# EAGLE schematic unified (EAGLE 7.7.0)

## Sheet 1 of 7
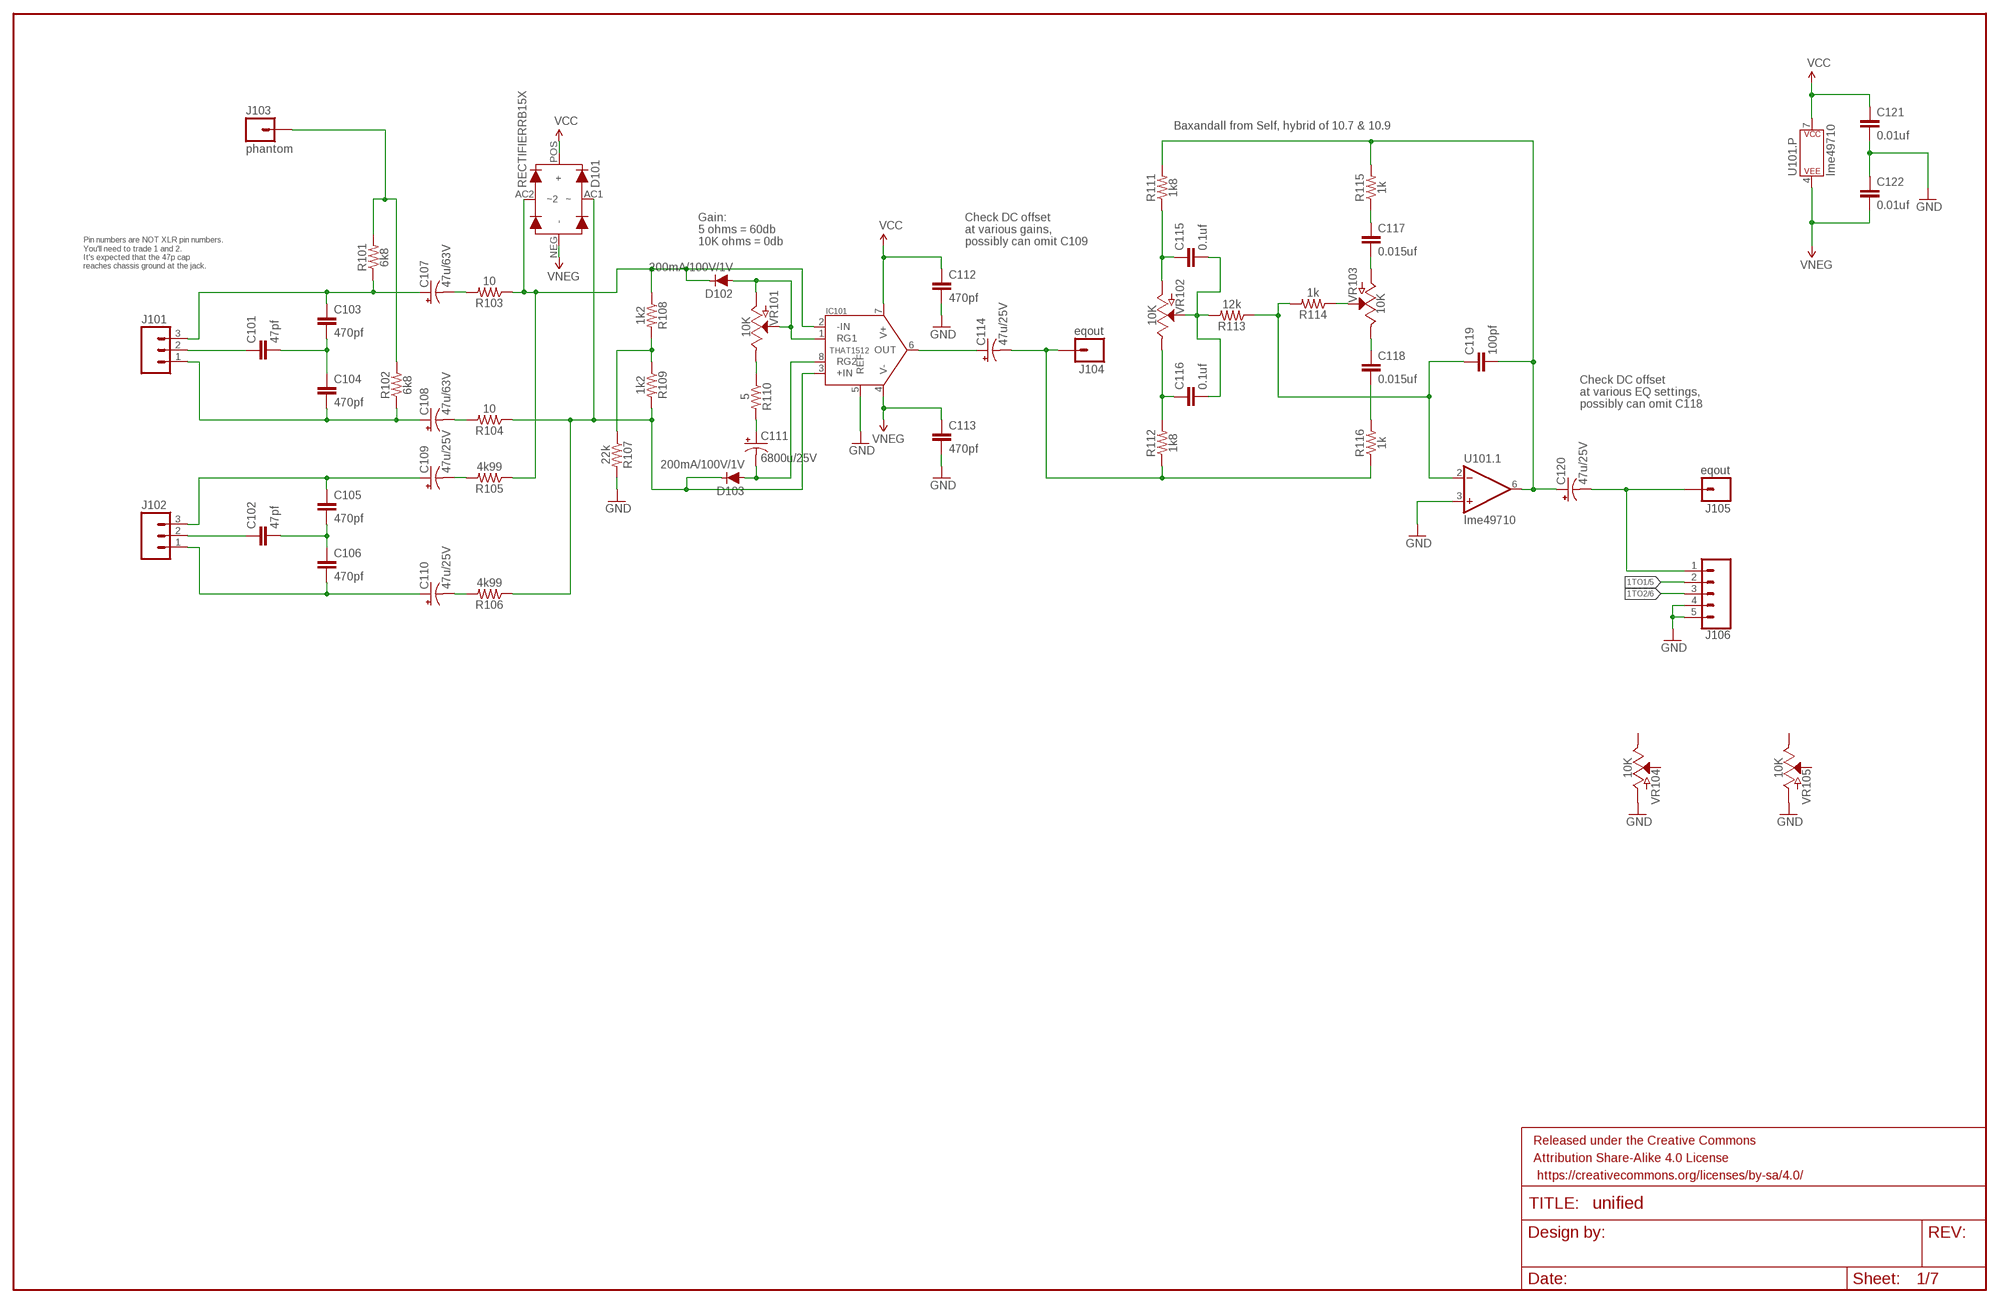
[diagram p0: schematic, sheet 1]

### Parts
C101  47pf  CAP-CERAMIC47PF  [CAP-KEMET-GM-2.54LS]
C102  47pf  CAP-CERAMIC47PF  [CAP-KEMET-GM-2.54LS]
C103  470pf  CAP-CERAMIC470PF  [CAP-KEMET-GM-2.54LS]
C104  470pf  CAP-CERAMIC470PF  [CAP-KEMET-GM-2.54LS]
C105  470pf  CAP-CERAMIC470PF  [CAP-KEMET-GM-2.54LS]
C106  470pf  CAP-CERAMIC470PF  [CAP-KEMET-GM-2.54LS]
C107  47u/63V  CAP-LYTIC47U/63V  [CAP-PANA-2LS-6DIAM]
C108  47u/63V  CAP-LYTIC47U/63V  [CAP-PANA-2LS-6DIAM]
C109  47u/25V  CAP-LYTIC47U/25V  [CAP-PANA-2LS-5DIAM]
C110  47u/25V  CAP-LYTIC47U/25V  [CAP-PANA-2LS-5DIAM]
C111  6800u/25V  CAP-LYTIC6800U/10V  [CAP-PANA-5LS-12.5DIAM]
C112  470pf  CAP-CERAMIC470PF  [CAP-KEMET-GM-2.54LS]
C113  470pf  CAP-CERAMIC470PF  [CAP-KEMET-GM-2.54LS]
C114  47u/25V  CAP-LYTIC47U/25V  [CAP-PANA-2LS-5DIAM]
C115  0.1uf  WIMA-MKS20.1UF  [WIMA-MKS2-2.5X7.2]
C116  0.1uf  WIMA-MKS20.1UF  [WIMA-MKS2-2.5X7.2]
C117  0.015uf  WIMA-MKS20.015UF  [WIMA-MKS2-2.5X7.2]
C118  0.015uf  WIMA-MKS20.015UF  [WIMA-MKS2-2.5X7.2]
C119  100pf  CAP-CERAMIC100PF  [CAP-KEMET-GM-2.54LS]
C120  47u/25V  CAP-LYTIC47U/25V  [CAP-PANA-2LS-5DIAM]
C121  0.01uf  WIMA-MKS20.01UF  [WIMA-MKS2-2.5X7.2]
C122  0.01uf  WIMA-MKS20.01UF  [WIMA-MKS2-2.5X7.2]
D101  RECTIFIERRB15X  [SM-RECTIFIER]
D102  200mA/100V/1V  DIODE-1N4148  [DIODE-1N4148]
D103  200mA/100V/1V  DIODE-1N4148  [DIODE-1N4148]
FRAME101  FRAME-LEDGER  [CREATIVE_COMMONS]
IC101  THAT1512  THAT151X  [DIP08-KIT]
J101  M031X03_NO_SILK  [1X03_NO_SILK@1]
J102  M031X03_NO_SILK  [1X03_NO_SILK@1]
J103  phantom  M01NOSILK-KIT  [1X01NS-KIT]
J104  eqout  M01NOSILK-KIT  [1X01NS-KIT]
J105  eqout  M01NOSILK-KIT  [1X01NS-KIT]
J106  CONN_05PTH_LONGPADS  [1X05_LONGPADS]
R101  6k8  RESISTOR  [AXIAL-0.3]
R102  6k8  RESISTOR  [AXIAL-0.3]
R103  10  RESISTOR  [AXIAL-0.3]
R104  10  RESISTOR  [AXIAL-0.3]
R105  4k99  RESISTOR  [AXIAL-0.3]
R106  4k99  RESISTOR  [AXIAL-0.3]
R107  22k  RESISTOR  [AXIAL-0.3]
R108  1k2  RESISTOR  [AXIAL-0.3]
R109  1k2  RESISTOR  [AXIAL-0.3]
R110  5  RESISTOR  [AXIAL-0.3]
R111  1k8  RESISTOR  [AXIAL-0.3]
R112  1k8  RESISTOR  [AXIAL-0.3]
R113  12k  RESISTOR  [AXIAL-0.3]
R114  1k  RESISTOR  [AXIAL-0.3]
R115  1k  RESISTOR  [AXIAL-0.3]
R116  1k  RESISTOR  [AXIAL-0.3]
U101  lme49710  OPAMPLME49710  [DIP08-KIT]
VR101  10K  POTROT-SW-POT  [ROT-SW-POT]
VR102  10K  POT10K-VERTPIN  [ALPHA-RV24AF40-POT]
VR103  10K  POT10K-VERTPIN  [ALPHA-RV24AF40-POT]
VR104  10K  POT10K-VERTPIN  [ALPHA-RV24AF40-POT]
VR105  10K  POT10K-VERTPIN  [ALPHA-RV24AF40-POT]

### Nets
1TO1 [signal]: J106.2 ; also sheet 5
1TO2 [signal]: J106.3 ; also sheet 6
EQ1OUT [signal]: C120.NEG(-) J105.1 J106.1
GND [power]: C112.P$2 C113.P$2 C121.P$2 C122.P$1 IC101.5(REF) J106.4 J106.5 R107.P$2 U101.3(.1:+IN) VR104.CCW(A) VR105.CCW(A) ; also sheet 2,3,4,5,6,7
L1+ [signal]: C106.P$2 C110.POS(+) J102.1
L1- [signal]: C105.P$1 C109.POS(+) J102.3
L1GND [signal]: C102.P$1 J102.2
M1+ [signal]: C104.P$2 C108.POS(+) J101.1 R102.P$1
M1- [signal]: C103.P$1 C107.POS(+) J101.3 R101.P$1
M1GND [signal]: C101.P$1 J101.2
N$1 [signal]: C115.P$1 R111.P$1 VR102.CCW(A)
N$2 [signal]: C116.P$1 R112.P$2 VR102.CW(E)
N$3 [signal]: C119.P$1 R113.P$1 R114.P$2 U101.2(.1:-IN)
N$4 [signal]: C118.P$2 R116.P$2
N$6 [signal]: C119.P$2 C120.POS(+) R111.P$2 R115.P$2 U101.6(.1:OUT)
N$8: R114.P$1 VR103.WIP(S)
N$10: C118.P$1 VR103.CW(E)
N$14 [signal]: C115.P$2 C116.P$2 R113.P$2 VR102.WIP(S)
N$15: C117.P$2 VR103.CCW(A)
N$19: C117.P$1 R115.P$1
N$21 [signal]: C111.NEG(-) D103.A IC101.8(RG2)
N$22 [signal]: C114.POS(+) IC101.6(OUT)
N$24 [signal]: C101.P$2 C103.P$2 C104.P$1
N$27 [signal]: C108.NEG(-) R104.P$2
N$28: J103.1 R101.P$2 R102.P$2
N$29 [signal]: C107.NEG(-) R103.P$2
N$30 [signal]: D101.AC2(~2) D102.C IC101.2(-IN) R103.P$1 R105.P$1 R108.P$1
N$31 [signal]: D101.AC1(~) D103.C IC101.3(+IN) R104.P$1 R106.P$1 R109.P$2
N$32 [signal]: R107.P$1 R108.P$2 R109.P$1
N$33: D102.A IC101.1(RG1) VR101.CCW(A) VR101.WIP(S)
N$34 [signal]: R110.P$1 VR101.CW(E)
N$35 [signal]: C111.POS(+) R110.P$2
N$37 [signal]: C102.P$2 C105.P$2 C106.P$1
N$40 [signal]: C110.NEG(-) R106.P$2
N$42 [signal]: C109.NEG(-) R105.P$2
PREOUT [signal]: C114.NEG(-) J104.1 R112.P$1 R116.P$1
VCC [power]: C112.P$1 C121.P$1 D101.POS(+) IC101.7(V+) U101.7(.P:P$V+) ; also sheet 2,3,4,5,6,7
VNEG [power]: C113.P$1 C122.P$2 D101.NEG(-) IC101.4(V-) U101.4(.P:P$V-) ; also sheet 2,3,4,5,6,7
Unconnected: VR104.CW(E) VR104.WIP(S) VR105.CW(E) VR105.WIP(S)

### Notes on the sheet
- Baxandall from Self, hybrid of 10.7 & 10.9
- Gain: 
  5 ohms = 60db
  10K ohms = 0db
- Check DC offset 
  at various gains,
  possibly can omit C109
- Pin numbers are NOT XLR pin numbers.
  You'll need to trade 1 and 2.
  It's expected that the 47p cap
  reaches chassis ground at the jack.
- Check DC offset 
  at various EQ settings,
  possibly can omit C118

## Sheet 2 of 7
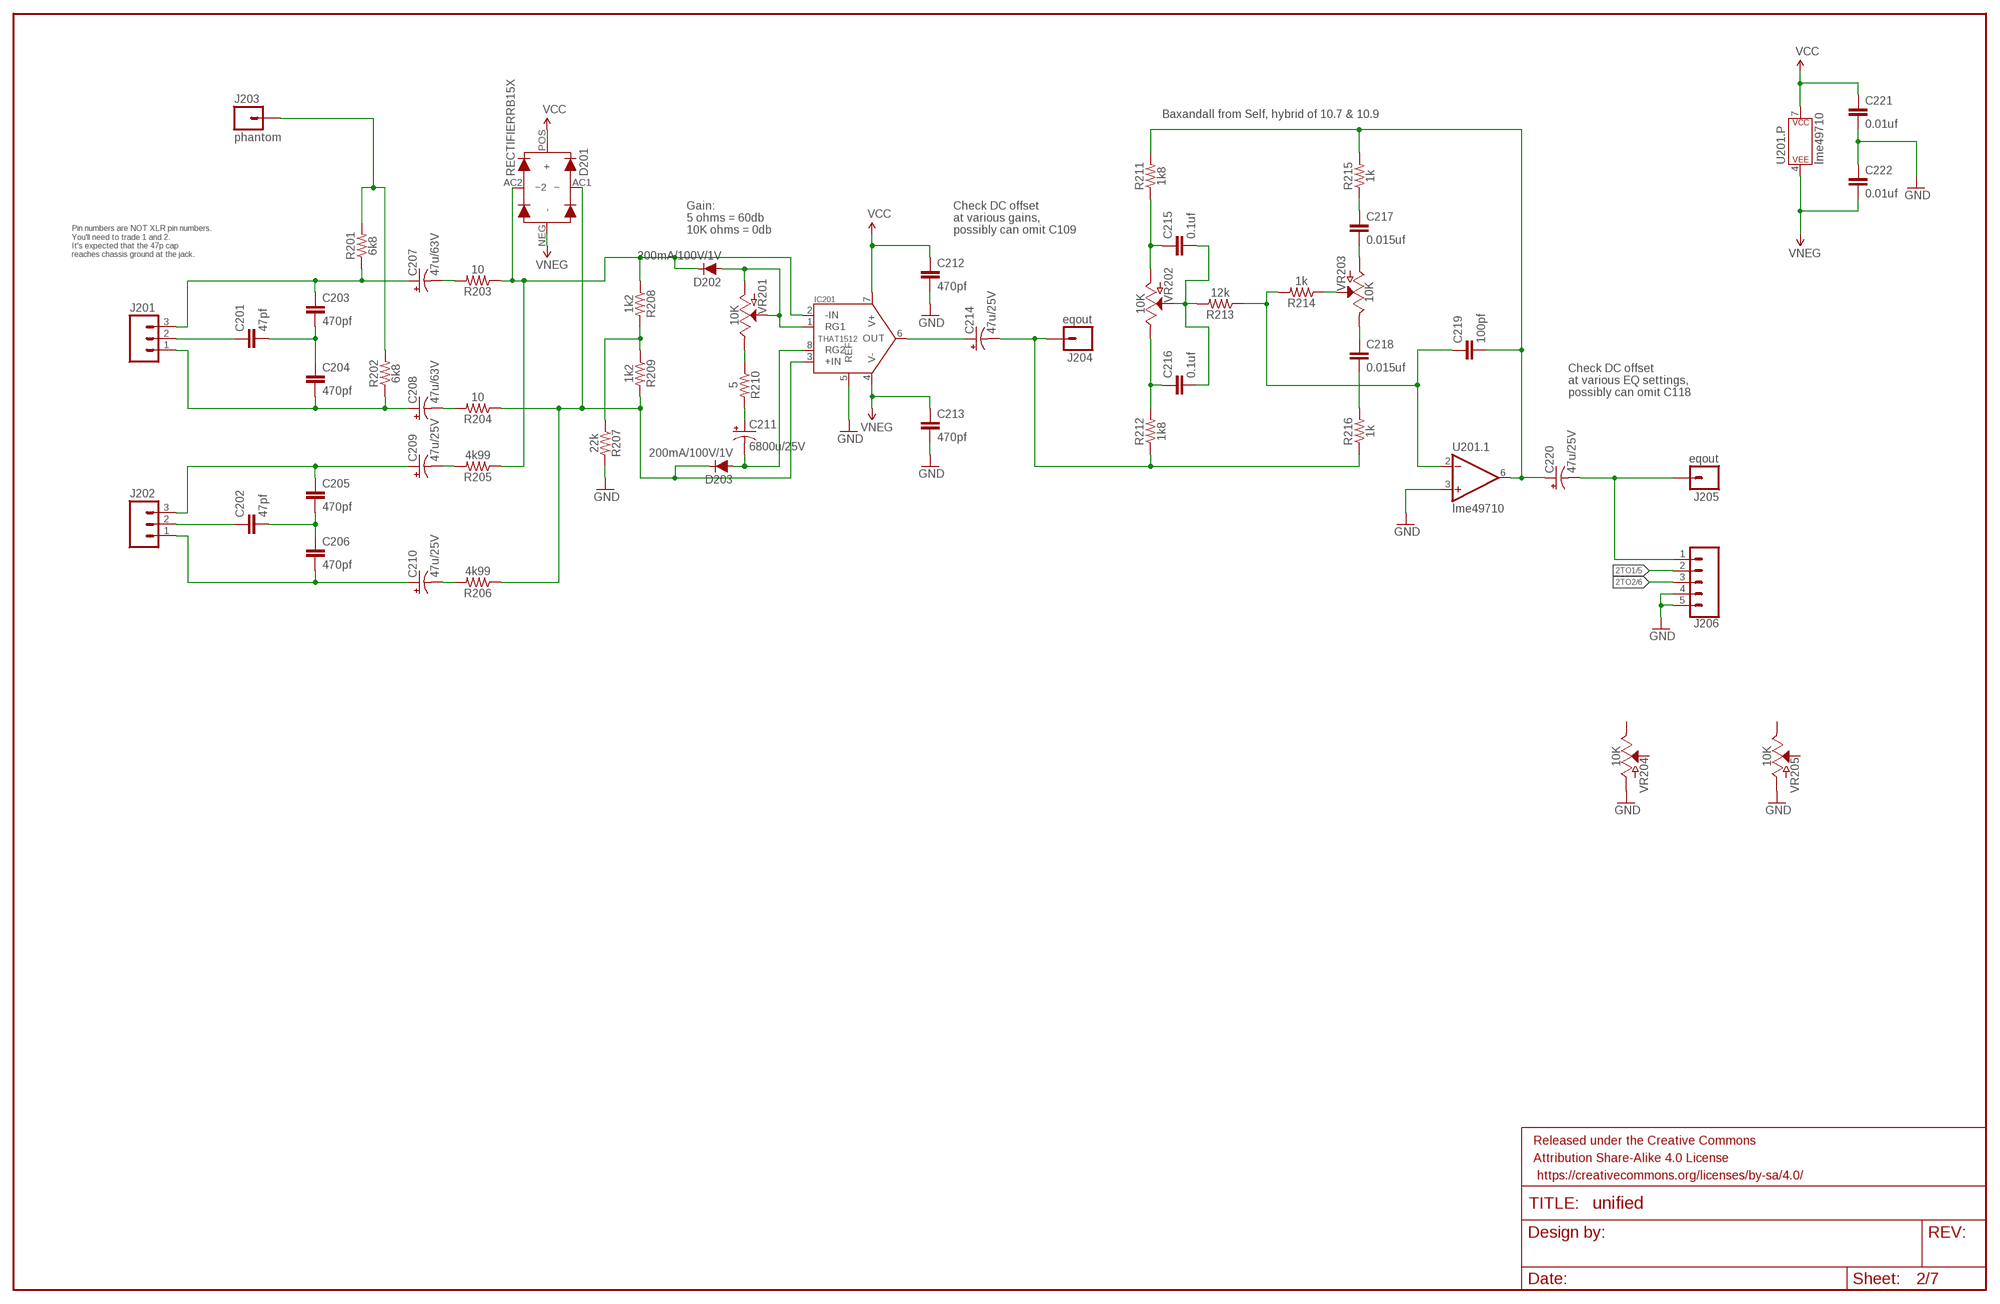
[diagram p1: schematic, sheet 2]

### Parts
C201  47pf  CAP-CERAMIC47PF  [CAP-KEMET-GM-2.54LS]
C202  47pf  CAP-CERAMIC47PF  [CAP-KEMET-GM-2.54LS]
C203  470pf  CAP-CERAMIC470PF  [CAP-KEMET-GM-2.54LS]
C204  470pf  CAP-CERAMIC470PF  [CAP-KEMET-GM-2.54LS]
C205  470pf  CAP-CERAMIC470PF  [CAP-KEMET-GM-2.54LS]
C206  470pf  CAP-CERAMIC470PF  [CAP-KEMET-GM-2.54LS]
C207  47u/63V  CAP-LYTIC47U/63V  [CAP-PANA-2LS-6DIAM]
C208  47u/63V  CAP-LYTIC47U/63V  [CAP-PANA-2LS-6DIAM]
C209  47u/25V  CAP-LYTIC47U/25V  [CAP-PANA-2LS-5DIAM]
C210  47u/25V  CAP-LYTIC47U/25V  [CAP-PANA-2LS-5DIAM]
C211  6800u/25V  CAP-LYTIC6800U/10V  [CAP-PANA-5LS-12.5DIAM]
C212  470pf  CAP-CERAMIC470PF  [CAP-KEMET-GM-2.54LS]
C213  470pf  CAP-CERAMIC470PF  [CAP-KEMET-GM-2.54LS]
C214  47u/25V  CAP-LYTIC47U/25V  [CAP-PANA-2LS-5DIAM]
C215  0.1uf  WIMA-MKS20.1UF  [WIMA-MKS2-2.5X7.2]
C216  0.1uf  WIMA-MKS20.1UF  [WIMA-MKS2-2.5X7.2]
C217  0.015uf  WIMA-MKS20.015UF  [WIMA-MKS2-2.5X7.2]
C218  0.015uf  WIMA-MKS20.015UF  [WIMA-MKS2-2.5X7.2]
C219  100pf  CAP-CERAMIC100PF  [CAP-KEMET-GM-2.54LS]
C220  47u/25V  CAP-LYTIC47U/25V  [CAP-PANA-2LS-5DIAM]
C221  0.01uf  WIMA-MKS20.01UF  [WIMA-MKS2-2.5X7.2]
C222  0.01uf  WIMA-MKS20.01UF  [WIMA-MKS2-2.5X7.2]
D201  RECTIFIERRB15X  [SM-RECTIFIER]
D202  200mA/100V/1V  DIODE-1N4148  [DIODE-1N4148]
D203  200mA/100V/1V  DIODE-1N4148  [DIODE-1N4148]
FRAME201  FRAME-LEDGER  [CREATIVE_COMMONS]
IC201  THAT1512  THAT151X  [DIP08-KIT]
J201  M031X03_NO_SILK  [1X03_NO_SILK@1]
J202  M031X03_NO_SILK  [1X03_NO_SILK@1]
J203  phantom  M01NOSILK-KIT  [1X01NS-KIT]
J204  eqout  M01NOSILK-KIT  [1X01NS-KIT]
J205  eqout  M01NOSILK-KIT  [1X01NS-KIT]
J206  CONN_05PTH_LONGPADS  [1X05_LONGPADS]
R201  6k8  RESISTOR  [AXIAL-0.3]
R202  6k8  RESISTOR  [AXIAL-0.3]
R203  10  RESISTOR  [AXIAL-0.3]
R204  10  RESISTOR  [AXIAL-0.3]
R205  4k99  RESISTOR  [AXIAL-0.3]
R206  4k99  RESISTOR  [AXIAL-0.3]
R207  22k  RESISTOR  [AXIAL-0.3]
R208  1k2  RESISTOR  [AXIAL-0.3]
R209  1k2  RESISTOR  [AXIAL-0.3]
R210  5  RESISTOR  [AXIAL-0.3]
R211  1k8  RESISTOR  [AXIAL-0.3]
R212  1k8  RESISTOR  [AXIAL-0.3]
R213  12k  RESISTOR  [AXIAL-0.3]
R214  1k  RESISTOR  [AXIAL-0.3]
R215  1k  RESISTOR  [AXIAL-0.3]
R216  1k  RESISTOR  [AXIAL-0.3]
U201  lme49710  OPAMPLME49710  [DIP08-KIT]
VR201  10K  POTROT-SW-POT  [ROT-SW-POT]
VR202  10K  POT10K-VERTPIN  [ALPHA-RV24AF40-POT]
VR203  10K  POT10K-VERTPIN  [ALPHA-RV24AF40-POT]
VR204  10K  POT10K-VERTPIN  [ALPHA-RV24AF40-POT]
VR205  10K  POT10K-VERTPIN  [ALPHA-RV24AF40-POT]

### Nets
2TO1 [signal]: J206.2 ; also sheet 5
2TO2 [signal]: J206.3 ; also sheet 6
EQ2OUT: C220.NEG(-) J205.1 J206.1
GND [power]: C212.P$2 C213.P$2 C221.P$2 C222.P$1 IC201.5(REF) J206.4 J206.5 R207.P$2 U201.3(.1:+IN) VR204.CCW(A) VR205.CCW(A) ; also sheet 1,3,4,5,6,7
N$20: C214.NEG(-) J204.1 R212.P$1 R216.P$1
N$50: C215.P$1 R211.P$1 VR202.CCW(A)
N$55: C216.P$1 R212.P$2 VR202.CW(E)
N$56: R214.P$1 VR203.WIP(S)
N$57: C215.P$2 C216.P$2 R213.P$2 VR202.WIP(S)
N$58: C218.P$2 R216.P$2
N$59: C217.P$1 R215.P$1
N$60: C219.P$1 R213.P$1 R214.P$2 U201.2(.1:-IN)
N$61: C214.POS(+) IC201.6(OUT)
N$62: C201.P$1 J201.2
N$63: C201.P$2 C203.P$2 C204.P$1
N$64: C203.P$1 C207.POS(+) J201.3 R201.P$1
N$65: C204.P$2 C208.POS(+) J201.1 R202.P$1
N$66: C208.NEG(-) R204.P$2
N$67: J203.1 R201.P$2 R202.P$2
N$68: C207.NEG(-) R203.P$2
N$69: R207.P$1 R208.P$2 R209.P$1
N$70: C211.NEG(-) D203.A IC201.8(RG2)
N$71: D202.A IC201.1(RG1) VR201.CCW(A) VR201.WIP(S)
N$72: C218.P$1 VR203.CW(E)
N$73: C217.P$2 VR203.CCW(A)
N$74: R210.P$1 VR201.CW(E)
N$75: C211.POS(+) R210.P$2
N$76: C202.P$1 J202.2
N$77: C202.P$2 C205.P$2 C206.P$1
N$78: C205.P$1 C209.POS(+) J202.3
N$79: C206.P$2 C210.POS(+) J202.1
N$80: C210.NEG(-) R206.P$2
N$81: C209.NEG(-) R205.P$2
N$82: D201.AC2(~2) D202.C IC201.2(-IN) R203.P$1 R205.P$1 R208.P$1
N$83: D201.AC1(~) D203.C IC201.3(+IN) R204.P$1 R206.P$1 R209.P$2
N$84: C219.P$2 C220.POS(+) R211.P$2 R215.P$2 U201.6(.1:OUT)
VCC [power]: C212.P$1 C221.P$1 D201.POS(+) IC201.7(V+) U201.7(.P:P$V+) ; also sheet 1,3,4,5,6,7
VNEG [power]: C213.P$1 C222.P$2 D201.NEG(-) IC201.4(V-) U201.4(.P:P$V-) ; also sheet 1,3,4,5,6,7
Unconnected: VR204.CW(E) VR204.WIP(S) VR205.CW(E) VR205.WIP(S)

### Notes on the sheet
- Baxandall from Self, hybrid of 10.7 & 10.9
- Gain: 
  5 ohms = 60db
  10K ohms = 0db
- Check DC offset 
  at various gains,
  possibly can omit C109
- Pin numbers are NOT XLR pin numbers.
  You'll need to trade 1 and 2.
  It's expected that the 47p cap
  reaches chassis ground at the jack.
- Check DC offset 
  at various EQ settings,
  possibly can omit C118

## Sheet 3 of 7
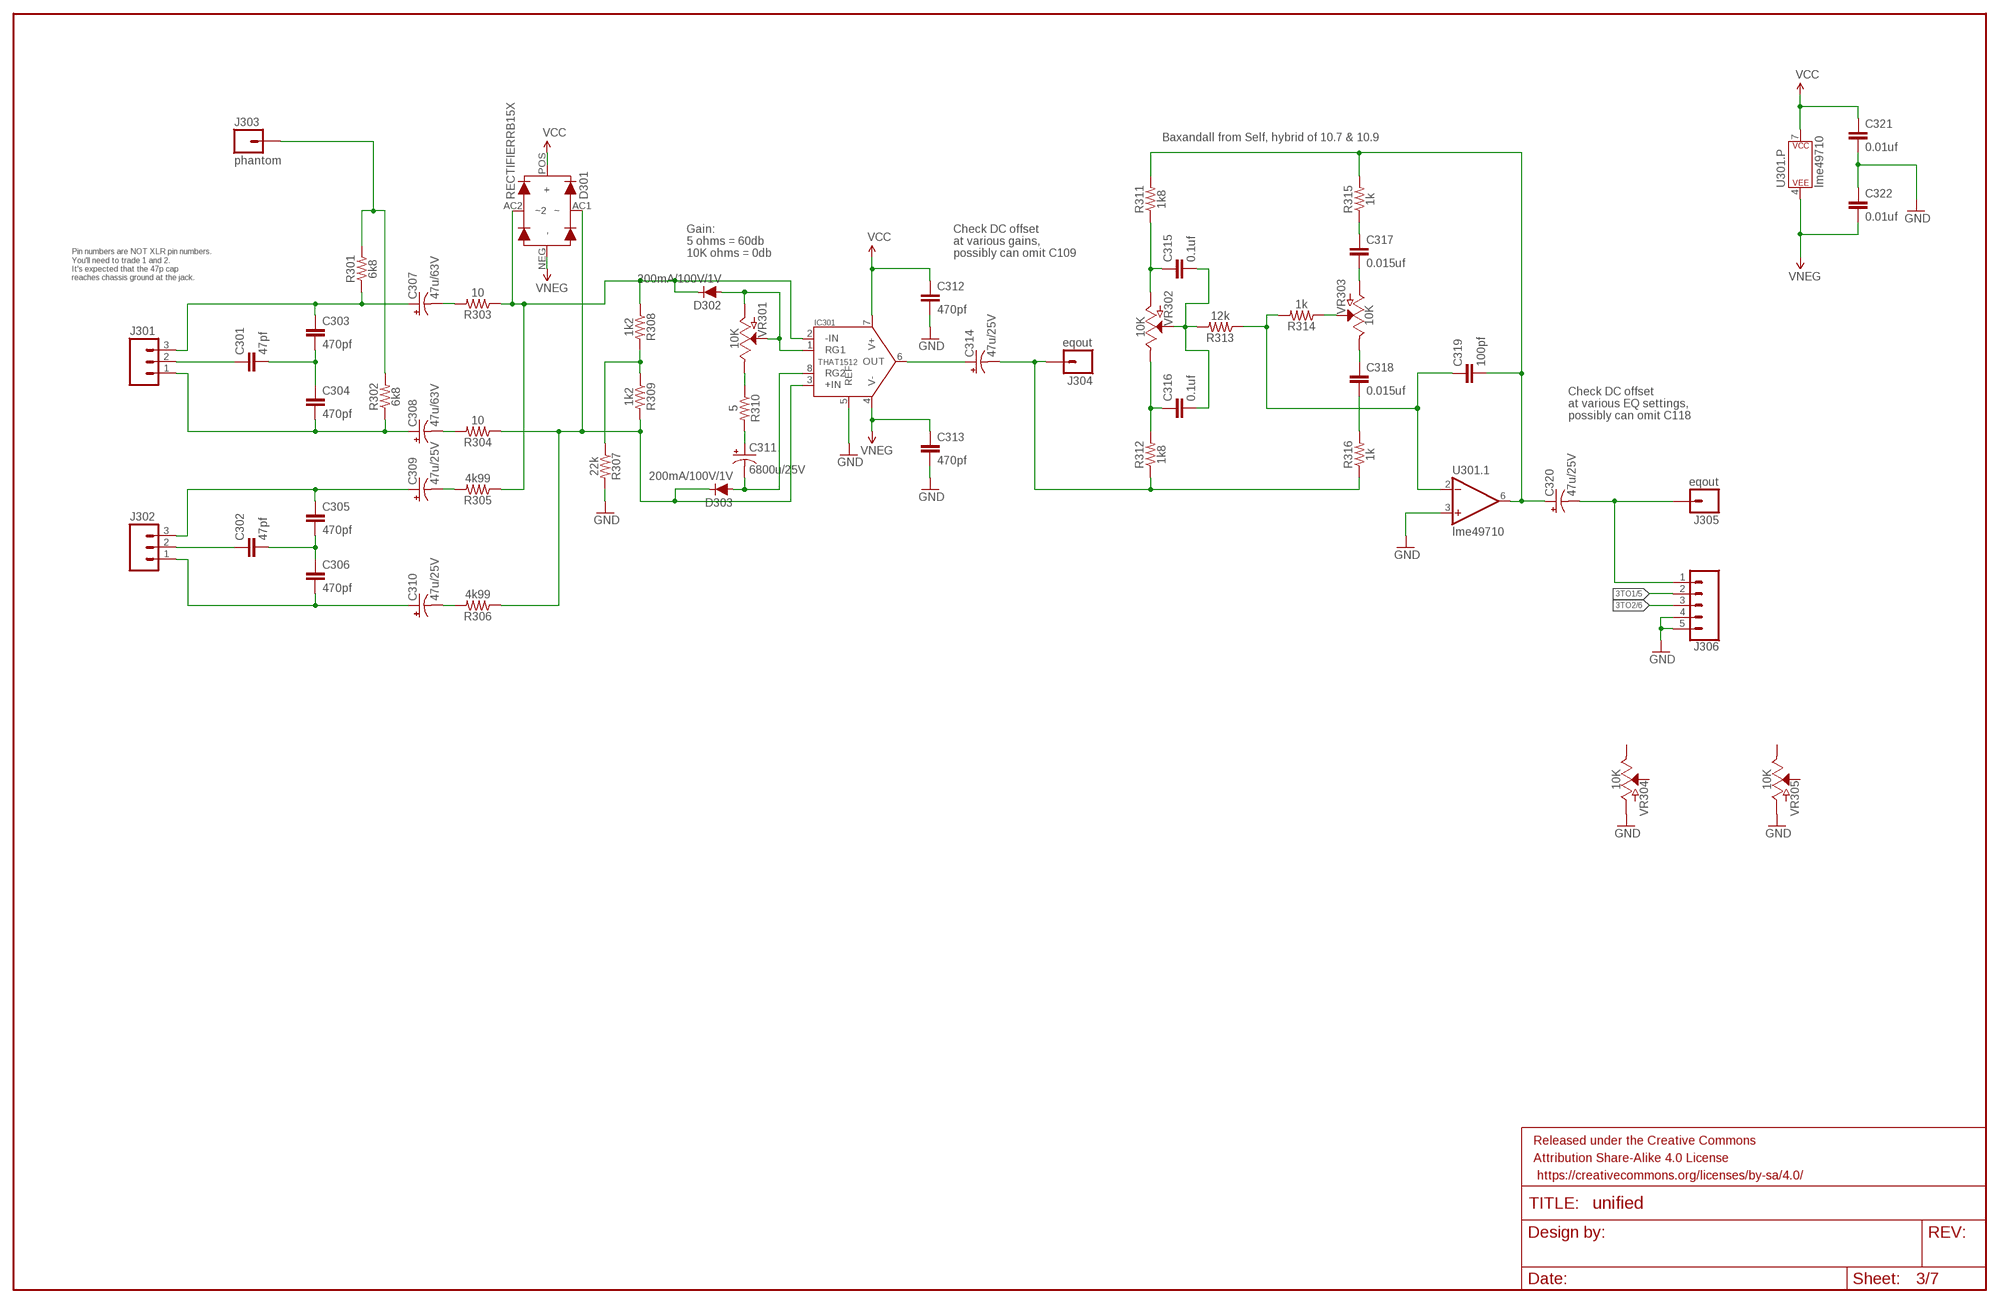
[diagram p2: schematic, sheet 3]

### Parts
C301  47pf  CAP-CERAMIC47PF  [CAP-KEMET-GM-2.54LS]
C302  47pf  CAP-CERAMIC47PF  [CAP-KEMET-GM-2.54LS]
C303  470pf  CAP-CERAMIC470PF  [CAP-KEMET-GM-2.54LS]
C304  470pf  CAP-CERAMIC470PF  [CAP-KEMET-GM-2.54LS]
C305  470pf  CAP-CERAMIC470PF  [CAP-KEMET-GM-2.54LS]
C306  470pf  CAP-CERAMIC470PF  [CAP-KEMET-GM-2.54LS]
C307  47u/63V  CAP-LYTIC47U/63V  [CAP-PANA-2LS-6DIAM]
C308  47u/63V  CAP-LYTIC47U/63V  [CAP-PANA-2LS-6DIAM]
C309  47u/25V  CAP-LYTIC47U/25V  [CAP-PANA-2LS-5DIAM]
C310  47u/25V  CAP-LYTIC47U/25V  [CAP-PANA-2LS-5DIAM]
C311  6800u/25V  CAP-LYTIC6800U/10V  [CAP-PANA-5LS-12.5DIAM]
C312  470pf  CAP-CERAMIC470PF  [CAP-KEMET-GM-2.54LS]
C313  470pf  CAP-CERAMIC470PF  [CAP-KEMET-GM-2.54LS]
C314  47u/25V  CAP-LYTIC47U/25V  [CAP-PANA-2LS-5DIAM]
C315  0.1uf  WIMA-MKS20.1UF  [WIMA-MKS2-2.5X7.2]
C316  0.1uf  WIMA-MKS20.1UF  [WIMA-MKS2-2.5X7.2]
C317  0.015uf  WIMA-MKS20.015UF  [WIMA-MKS2-2.5X7.2]
C318  0.015uf  WIMA-MKS20.015UF  [WIMA-MKS2-2.5X7.2]
C319  100pf  CAP-CERAMIC100PF  [CAP-KEMET-GM-2.54LS]
C320  47u/25V  CAP-LYTIC47U/25V  [CAP-PANA-2LS-5DIAM]
C321  0.01uf  WIMA-MKS20.01UF  [WIMA-MKS2-2.5X7.2]
C322  0.01uf  WIMA-MKS20.01UF  [WIMA-MKS2-2.5X7.2]
D301  RECTIFIERRB15X  [SM-RECTIFIER]
D302  200mA/100V/1V  DIODE-1N4148  [DIODE-1N4148]
D303  200mA/100V/1V  DIODE-1N4148  [DIODE-1N4148]
FRAME301  FRAME-LEDGER  [CREATIVE_COMMONS]
IC301  THAT1512  THAT151X  [DIP08-KIT]
J301  M031X03_NO_SILK  [1X03_NO_SILK@1]
J302  M031X03_NO_SILK  [1X03_NO_SILK@1]
J303  phantom  M01NOSILK-KIT  [1X01NS-KIT]
J304  eqout  M01NOSILK-KIT  [1X01NS-KIT]
J305  eqout  M01NOSILK-KIT  [1X01NS-KIT]
J306  CONN_05PTH_LONGPADS  [1X05_LONGPADS]
R301  6k8  RESISTOR  [AXIAL-0.3]
R302  6k8  RESISTOR  [AXIAL-0.3]
R303  10  RESISTOR  [AXIAL-0.3]
R304  10  RESISTOR  [AXIAL-0.3]
R305  4k99  RESISTOR  [AXIAL-0.3]
R306  4k99  RESISTOR  [AXIAL-0.3]
R307  22k  RESISTOR  [AXIAL-0.3]
R308  1k2  RESISTOR  [AXIAL-0.3]
R309  1k2  RESISTOR  [AXIAL-0.3]
R310  5  RESISTOR  [AXIAL-0.3]
R311  1k8  RESISTOR  [AXIAL-0.3]
R312  1k8  RESISTOR  [AXIAL-0.3]
R313  12k  RESISTOR  [AXIAL-0.3]
R314  1k  RESISTOR  [AXIAL-0.3]
R315  1k  RESISTOR  [AXIAL-0.3]
R316  1k  RESISTOR  [AXIAL-0.3]
U301  lme49710  OPAMPLME49710  [DIP08-KIT]
VR301  10K  POTROT-SW-POT  [ROT-SW-POT]
VR302  10K  POT10K-VERTPIN  [ALPHA-RV24AF40-POT]
VR303  10K  POT10K-VERTPIN  [ALPHA-RV24AF40-POT]
VR304  10K  POT10K-VERTPIN  [ALPHA-RV24AF40-POT]
VR305  10K  POT10K-VERTPIN  [ALPHA-RV24AF40-POT]

### Nets
3TO1 [signal]: J306.2 ; also sheet 5
3TO2 [signal]: J306.3 ; also sheet 6
EQ3OUT: C320.NEG(-) J305.1 J306.1
GND [power]: C312.P$2 C313.P$2 C321.P$2 C322.P$1 IC301.5(REF) J306.4 J306.5 R307.P$2 U301.3(.1:+IN) VR304.CCW(A) VR305.CCW(A) ; also sheet 1,2,4,5,6,7
N$85: C314.NEG(-) J304.1 R312.P$1 R316.P$1
N$86: C315.P$1 R311.P$1 VR302.CCW(A)
N$87: C316.P$1 R312.P$2 VR302.CW(E)
N$88: R314.P$1 VR303.WIP(S)
N$89: C315.P$2 C316.P$2 R313.P$2 VR302.WIP(S)
N$90: C318.P$2 R316.P$2
N$91: C317.P$1 R315.P$1
N$92: C319.P$1 R313.P$1 R314.P$2 U301.2(.1:-IN)
N$93: C314.POS(+) IC301.6(OUT)
N$94: C301.P$1 J301.2
N$95: C301.P$2 C303.P$2 C304.P$1
N$96: C303.P$1 C307.POS(+) J301.3 R301.P$1
N$97: C304.P$2 C308.POS(+) J301.1 R302.P$1
N$98: C308.NEG(-) R304.P$2
N$99: J303.1 R301.P$2 R302.P$2
N$100: C307.NEG(-) R303.P$2
N$101: R307.P$1 R308.P$2 R309.P$1
N$102: C311.NEG(-) D303.A IC301.8(RG2)
N$103: D302.A IC301.1(RG1) VR301.CCW(A) VR301.WIP(S)
N$104: C318.P$1 VR303.CW(E)
N$105: C317.P$2 VR303.CCW(A)
N$106: R310.P$1 VR301.CW(E)
N$107: C311.POS(+) R310.P$2
N$108: C302.P$1 J302.2
N$109: C302.P$2 C305.P$2 C306.P$1
N$110: C305.P$1 C309.POS(+) J302.3
N$111: C306.P$2 C310.POS(+) J302.1
N$112: C310.NEG(-) R306.P$2
N$113: C309.NEG(-) R305.P$2
N$114: D301.AC2(~2) D302.C IC301.2(-IN) R303.P$1 R305.P$1 R308.P$1
N$115: D301.AC1(~) D303.C IC301.3(+IN) R304.P$1 R306.P$1 R309.P$2
N$116: C319.P$2 C320.POS(+) R311.P$2 R315.P$2 U301.6(.1:OUT)
VCC [power]: C312.P$1 C321.P$1 D301.POS(+) IC301.7(V+) U301.7(.P:P$V+) ; also sheet 1,2,4,5,6,7
VNEG [power]: C313.P$1 C322.P$2 D301.NEG(-) IC301.4(V-) U301.4(.P:P$V-) ; also sheet 1,2,4,5,6,7
Unconnected: VR304.CW(E) VR304.WIP(S) VR305.CW(E) VR305.WIP(S)

### Notes on the sheet
- Baxandall from Self, hybrid of 10.7 & 10.9
- Gain: 
  5 ohms = 60db
  10K ohms = 0db
- Check DC offset 
  at various gains,
  possibly can omit C109
- Pin numbers are NOT XLR pin numbers.
  You'll need to trade 1 and 2.
  It's expected that the 47p cap
  reaches chassis ground at the jack.
- Check DC offset 
  at various EQ settings,
  possibly can omit C118

## Sheet 4 of 7
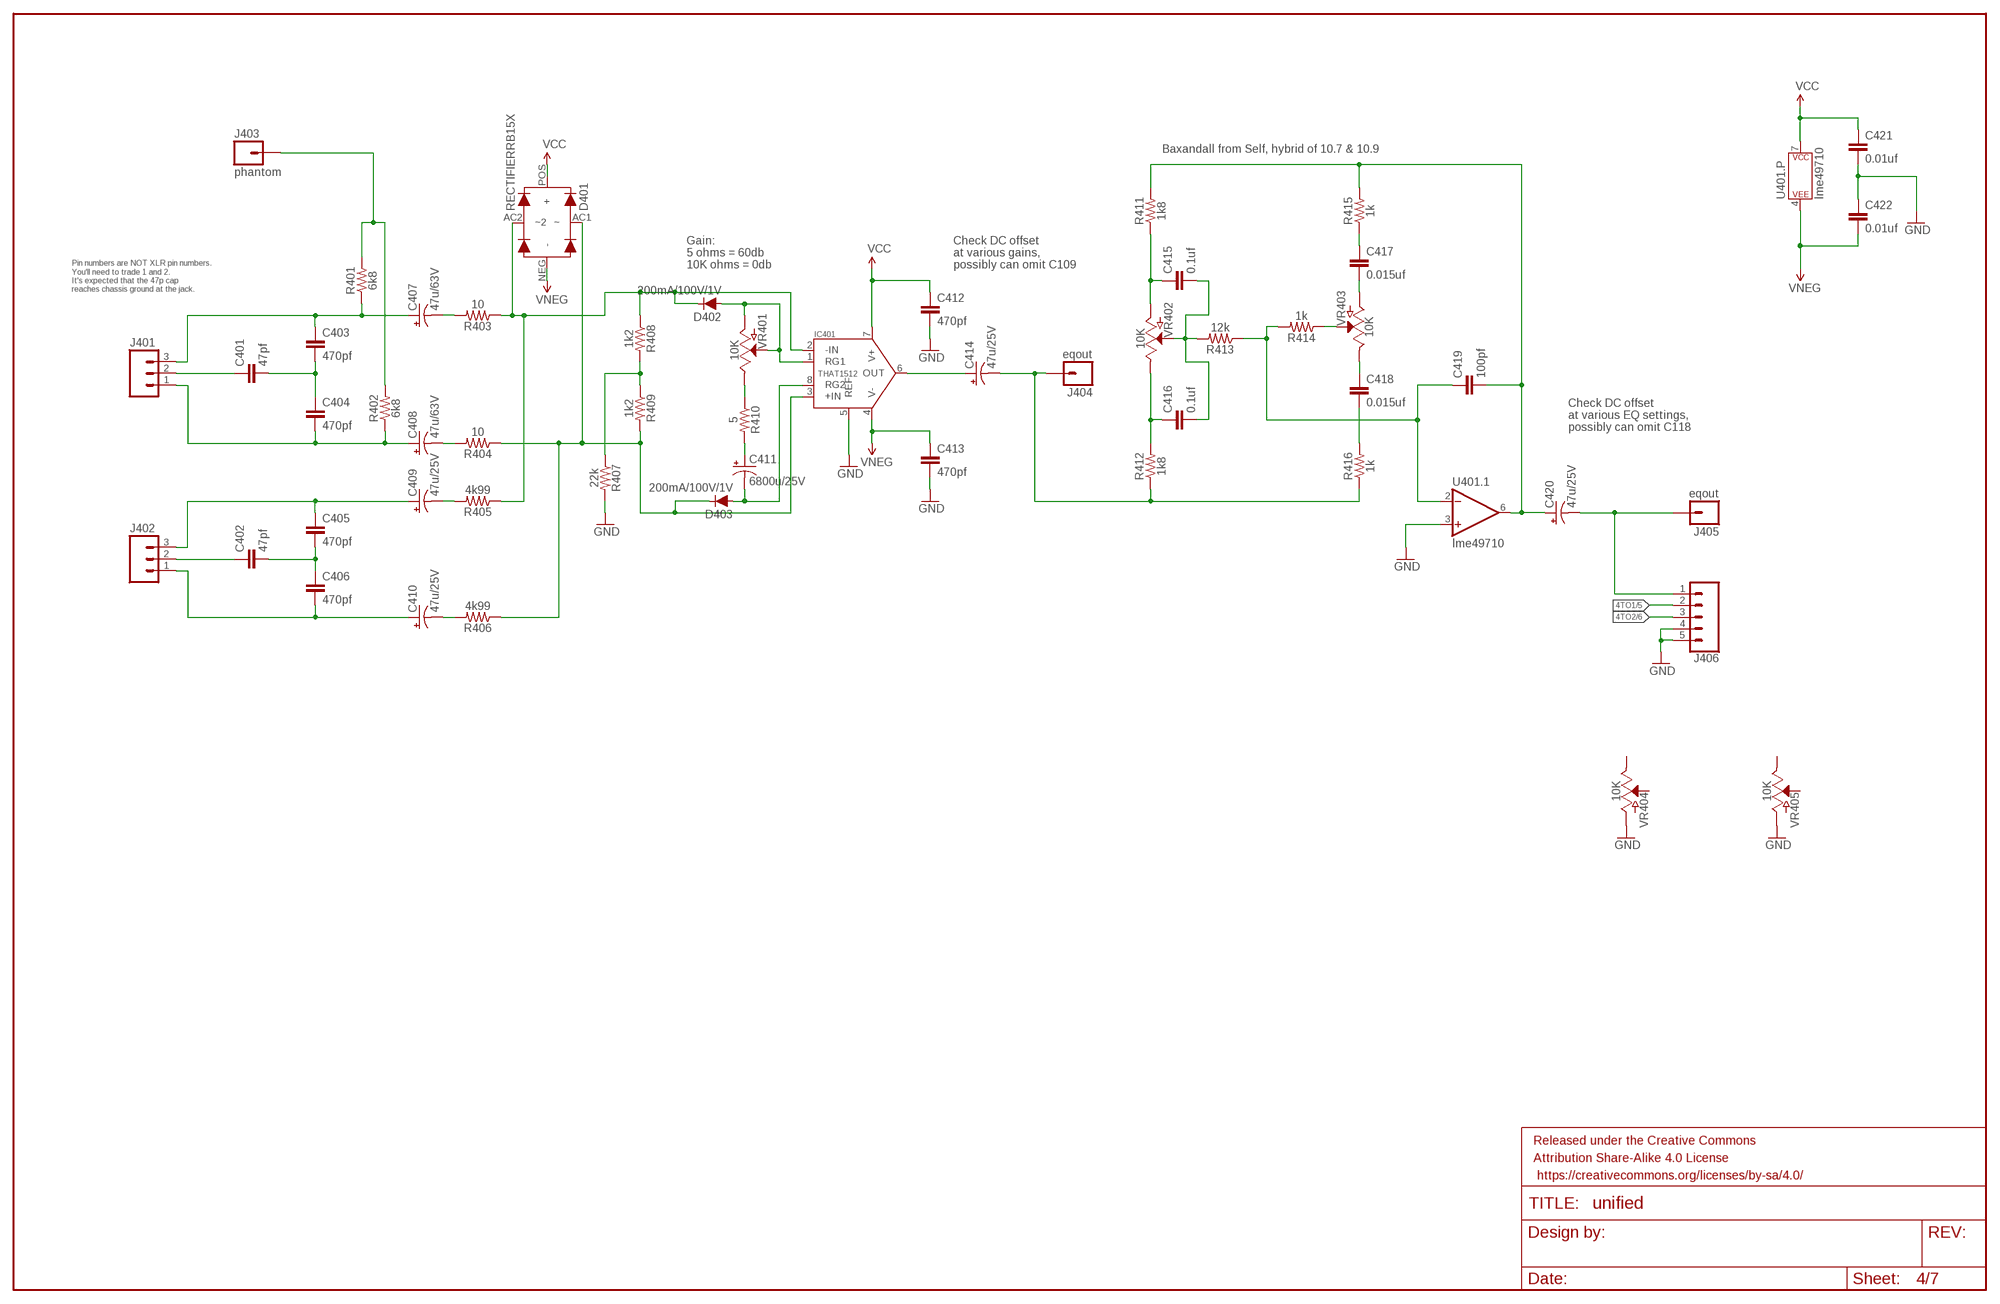
[diagram p3: schematic, sheet 4]

### Parts
C401  47pf  CAP-CERAMIC47PF  [CAP-KEMET-GM-2.54LS]
C402  47pf  CAP-CERAMIC47PF  [CAP-KEMET-GM-2.54LS]
C403  470pf  CAP-CERAMIC470PF  [CAP-KEMET-GM-2.54LS]
C404  470pf  CAP-CERAMIC470PF  [CAP-KEMET-GM-2.54LS]
C405  470pf  CAP-CERAMIC470PF  [CAP-KEMET-GM-2.54LS]
C406  470pf  CAP-CERAMIC470PF  [CAP-KEMET-GM-2.54LS]
C407  47u/63V  CAP-LYTIC47U/63V  [CAP-PANA-2LS-6DIAM]
C408  47u/63V  CAP-LYTIC47U/63V  [CAP-PANA-2LS-6DIAM]
C409  47u/25V  CAP-LYTIC47U/25V  [CAP-PANA-2LS-5DIAM]
C410  47u/25V  CAP-LYTIC47U/25V  [CAP-PANA-2LS-5DIAM]
C411  6800u/25V  CAP-LYTIC6800U/10V  [CAP-PANA-5LS-12.5DIAM]
C412  470pf  CAP-CERAMIC470PF  [CAP-KEMET-GM-2.54LS]
C413  470pf  CAP-CERAMIC470PF  [CAP-KEMET-GM-2.54LS]
C414  47u/25V  CAP-LYTIC47U/25V  [CAP-PANA-2LS-5DIAM]
C415  0.1uf  WIMA-MKS20.1UF  [WIMA-MKS2-2.5X7.2]
C416  0.1uf  WIMA-MKS20.1UF  [WIMA-MKS2-2.5X7.2]
C417  0.015uf  WIMA-MKS20.015UF  [WIMA-MKS2-2.5X7.2]
C418  0.015uf  WIMA-MKS20.015UF  [WIMA-MKS2-2.5X7.2]
C419  100pf  CAP-CERAMIC100PF  [CAP-KEMET-GM-2.54LS]
C420  47u/25V  CAP-LYTIC47U/25V  [CAP-PANA-2LS-5DIAM]
C421  0.01uf  WIMA-MKS20.01UF  [WIMA-MKS2-2.5X7.2]
C422  0.01uf  WIMA-MKS20.01UF  [WIMA-MKS2-2.5X7.2]
D401  RECTIFIERRB15X  [SM-RECTIFIER]
D402  200mA/100V/1V  DIODE-1N4148  [DIODE-1N4148]
D403  200mA/100V/1V  DIODE-1N4148  [DIODE-1N4148]
FRAME401  FRAME-LEDGER  [CREATIVE_COMMONS]
IC401  THAT1512  THAT151X  [DIP08-KIT]
J401  M031X03_NO_SILK  [1X03_NO_SILK@1]
J402  M031X03_NO_SILK  [1X03_NO_SILK@1]
J403  phantom  M01NOSILK-KIT  [1X01NS-KIT]
J404  eqout  M01NOSILK-KIT  [1X01NS-KIT]
J405  eqout  M01NOSILK-KIT  [1X01NS-KIT]
J406  CONN_05PTH_LONGPADS  [1X05_LONGPADS]
R401  6k8  RESISTOR  [AXIAL-0.3]
R402  6k8  RESISTOR  [AXIAL-0.3]
R403  10  RESISTOR  [AXIAL-0.3]
R404  10  RESISTOR  [AXIAL-0.3]
R405  4k99  RESISTOR  [AXIAL-0.3]
R406  4k99  RESISTOR  [AXIAL-0.3]
R407  22k  RESISTOR  [AXIAL-0.3]
R408  1k2  RESISTOR  [AXIAL-0.3]
R409  1k2  RESISTOR  [AXIAL-0.3]
R410  5  RESISTOR  [AXIAL-0.3]
R411  1k8  RESISTOR  [AXIAL-0.3]
R412  1k8  RESISTOR  [AXIAL-0.3]
R413  12k  RESISTOR  [AXIAL-0.3]
R414  1k  RESISTOR  [AXIAL-0.3]
R415  1k  RESISTOR  [AXIAL-0.3]
R416  1k  RESISTOR  [AXIAL-0.3]
U401  lme49710  OPAMPLME49710  [DIP08-KIT]
VR401  10K  POTROT-SW-POT  [ROT-SW-POT]
VR402  10K  POT10K-VERTPIN  [ALPHA-RV24AF40-POT]
VR403  10K  POT10K-VERTPIN  [ALPHA-RV24AF40-POT]
VR404  10K  POT10K-VERTPIN  [ALPHA-RV24AF40-POT]
VR405  10K  POT10K-VERTPIN  [ALPHA-RV24AF40-POT]

### Nets
4TO1 [signal]: J406.2 ; also sheet 5
4TO2 [signal]: J406.3 ; also sheet 6
EQ4OUT: C420.NEG(-) J405.1 J406.1
GND [power]: C412.P$2 C413.P$2 C421.P$2 C422.P$1 IC401.5(REF) J406.4 J406.5 R407.P$2 U401.3(.1:+IN) VR404.CCW(A) VR405.CCW(A) ; also sheet 1,2,3,5,6,7
N$117: C414.NEG(-) J404.1 R412.P$1 R416.P$1
N$118: C415.P$1 R411.P$1 VR402.CCW(A)
N$119: C416.P$1 R412.P$2 VR402.CW(E)
N$120: R414.P$1 VR403.WIP(S)
N$121: C415.P$2 C416.P$2 R413.P$2 VR402.WIP(S)
N$122: C418.P$2 R416.P$2
N$123: C417.P$1 R415.P$1
N$124: C419.P$1 R413.P$1 R414.P$2 U401.2(.1:-IN)
N$125: C414.POS(+) IC401.6(OUT)
N$126: C401.P$1 J401.2
N$127: C401.P$2 C403.P$2 C404.P$1
N$128: C403.P$1 C407.POS(+) J401.3 R401.P$1
N$129: C404.P$2 C408.POS(+) J401.1 R402.P$1
N$130: C408.NEG(-) R404.P$2
N$131: J403.1 R401.P$2 R402.P$2
N$132: C407.NEG(-) R403.P$2
N$133: R407.P$1 R408.P$2 R409.P$1
N$134: C411.NEG(-) D403.A IC401.8(RG2)
N$135: D402.A IC401.1(RG1) VR401.CCW(A) VR401.WIP(S)
N$136: C418.P$1 VR403.CW(E)
N$137: C417.P$2 VR403.CCW(A)
N$138: R410.P$1 VR401.CW(E)
N$139: C411.POS(+) R410.P$2
N$140: C402.P$1 J402.2
N$141: C402.P$2 C405.P$2 C406.P$1
N$142: C405.P$1 C409.POS(+) J402.3
N$143: C406.P$2 C410.POS(+) J402.1
N$144: C410.NEG(-) R406.P$2
N$145: C409.NEG(-) R405.P$2
N$146: D401.AC2(~2) D402.C IC401.2(-IN) R403.P$1 R405.P$1 R408.P$1
N$147: D401.AC1(~) D403.C IC401.3(+IN) R404.P$1 R406.P$1 R409.P$2
N$148: C419.P$2 C420.POS(+) R411.P$2 R415.P$2 U401.6(.1:OUT)
VCC [power]: C412.P$1 C421.P$1 D401.POS(+) IC401.7(V+) U401.7(.P:P$V+) ; also sheet 1,2,3,5,6,7
VNEG [power]: C413.P$1 C422.P$2 D401.NEG(-) IC401.4(V-) U401.4(.P:P$V-) ; also sheet 1,2,3,5,6,7
Unconnected: VR404.CW(E) VR404.WIP(S) VR405.CW(E) VR405.WIP(S)

### Notes on the sheet
- Baxandall from Self, hybrid of 10.7 & 10.9
- Gain: 
  5 ohms = 60db
  10K ohms = 0db
- Check DC offset 
  at various gains,
  possibly can omit C109
- Pin numbers are NOT XLR pin numbers.
  You'll need to trade 1 and 2.
  It's expected that the 47p cap
  reaches chassis ground at the jack.
- Check DC offset 
  at various EQ settings,
  possibly can omit C118

## Sheet 5 of 7
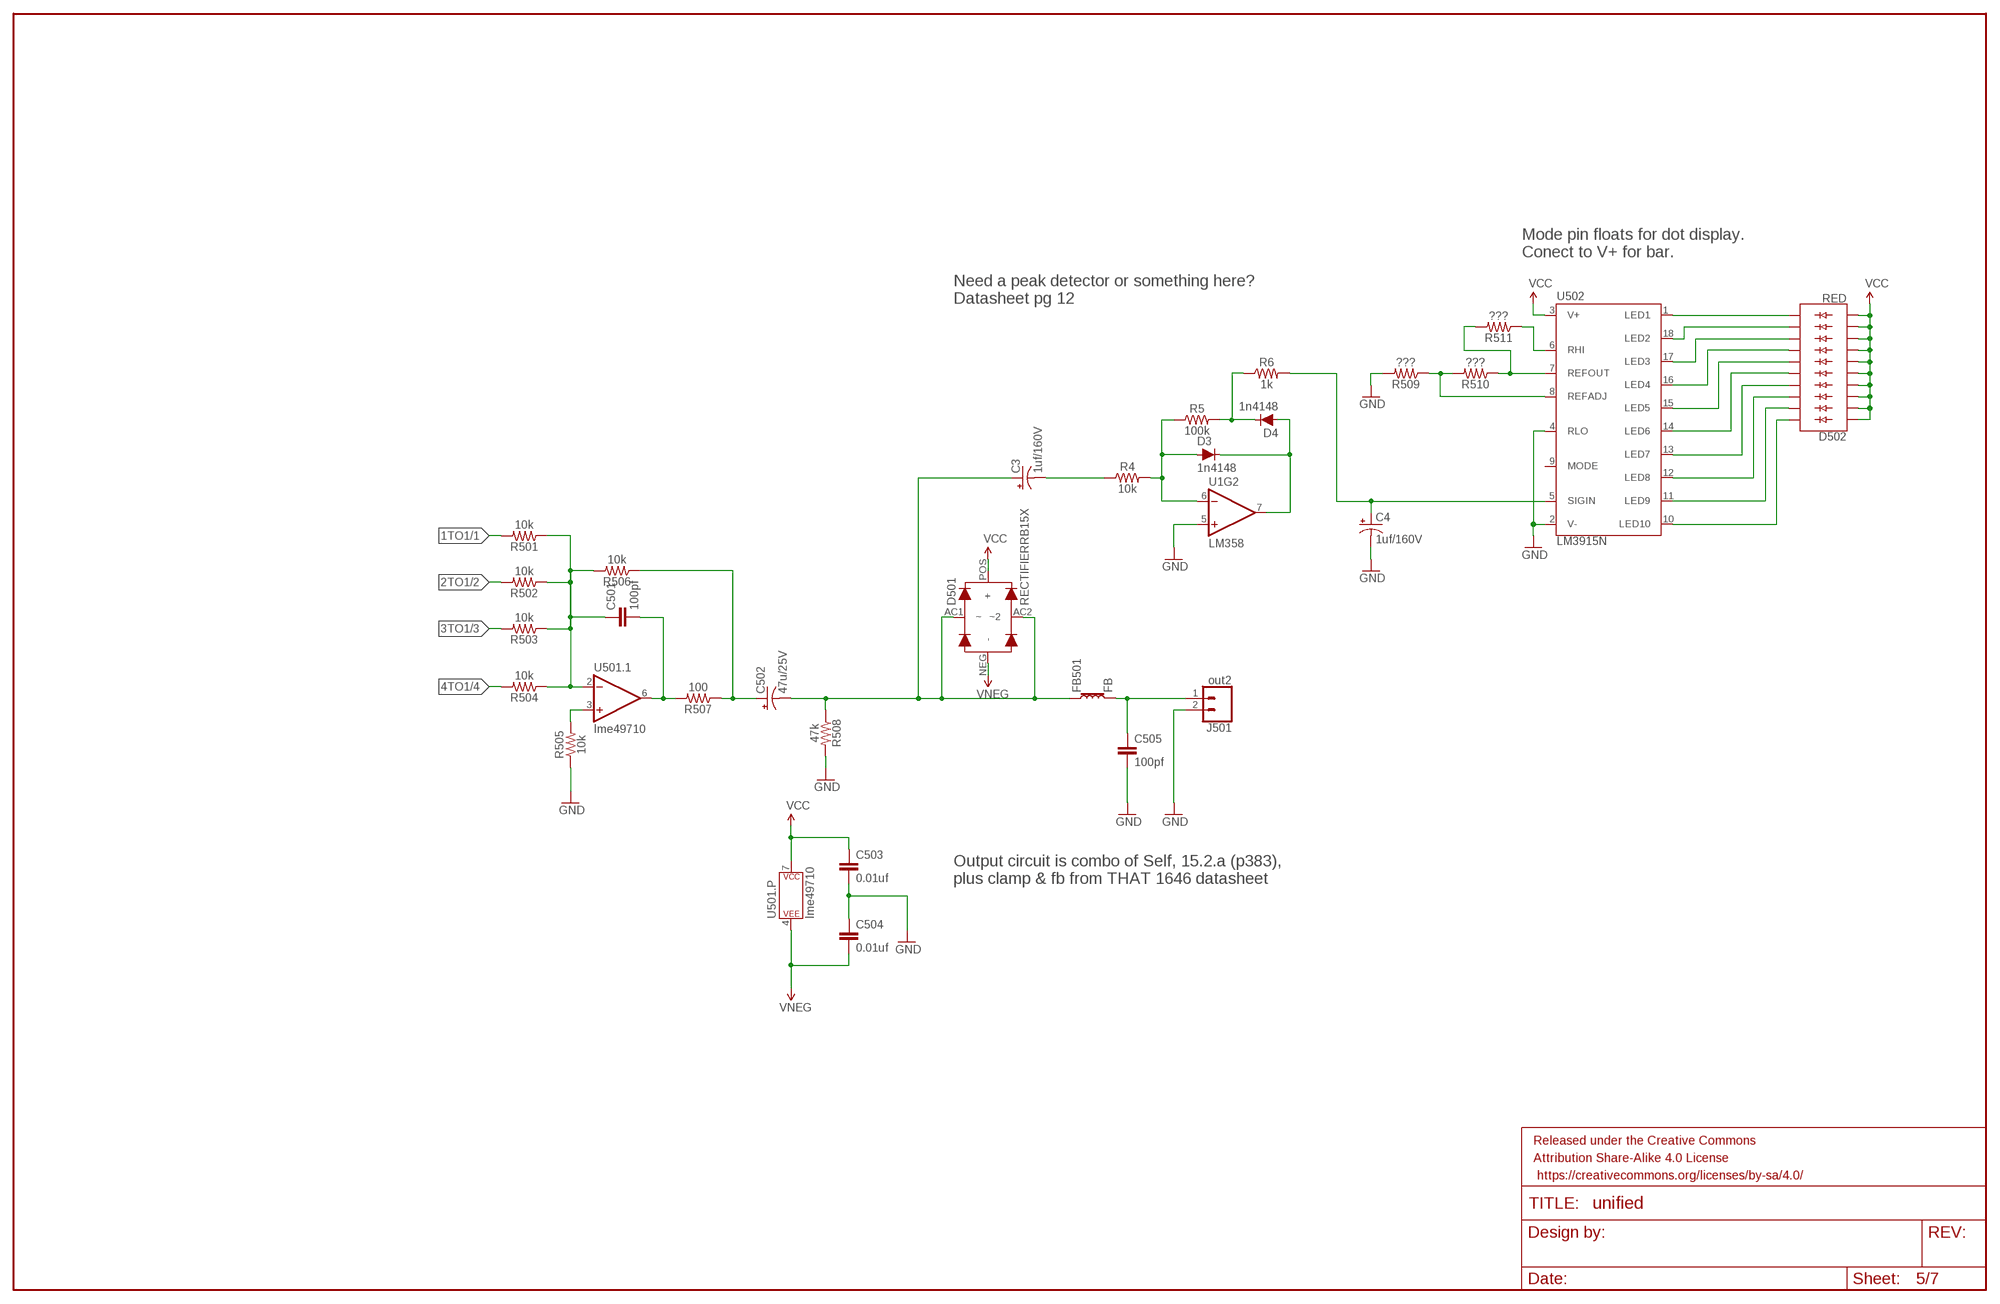
[diagram p4: schematic, sheet 5]

### Parts
C3  1uf/160V  CAP-LYTIC1UF/160V  [CAP-PANA-2.5LS-6DIAM]
C4  1uf/160V  CAP-LYTIC1UF/160V  [CAP-PANA-2.5LS-6DIAM]
C501  100pf  CAP-CERAMIC100PF  [CAP-KEMET-GM-2.54LS]
C502  47u/25V  CAP-LYTIC47U/25V  [CAP-PANA-2LS-5DIAM]
C503  0.01uf  WIMA-MKS20.01UF  [WIMA-MKS2-2.5X7.2]
C504  0.01uf  WIMA-MKS20.01UF  [WIMA-MKS2-2.5X7.2]
C505  100pf  CAP-CERAMIC100PF  [CAP-KEMET-GM-2.54LS]
D3  1n4148  DIODE-1N4148  [DIODE-1N4148]
D4  1n4148  DIODE-1N4148  [DIODE-1N4148]
D501  RECTIFIERRB15X  [SM-RECTIFIER]
D502  RED  LED_BARGRAPH_10RED  [LED_BARGRAPH_10]
FB501  FB  [BEAD]
FRAME501  FRAME-LEDGER  [CREATIVE_COMMONS]
J501  out2  CONN_02LOCK_LONGPADS  [1X02_LOCK_LONGPADS]
R4  10k  RESISTOR  [AXIAL-0.3]
R5  100k  RESISTOR  [AXIAL-0.3]
R6  1k  RESISTOR  [AXIAL-0.3]
R501  10k  RESISTOR  [AXIAL-0.3]
R502  10k  RESISTOR  [AXIAL-0.3]
R503  10k  RESISTOR  [AXIAL-0.3]
R504  10k  RESISTOR  [AXIAL-0.3]
R505  10k  RESISTOR  [AXIAL-0.3]
R506  10k  RESISTOR  [AXIAL-0.3]
R507  100  RESISTOR  [AXIAL-0.3]
R508  47k  RESISTOR  [AXIAL-0.3]
R509  ???  RESISTOR  [AXIAL-0.3]
R510  ???  RESISTOR  [AXIAL-0.3]
R511  ???  RESISTOR  [AXIAL-0.3]
U1  LM358  [DIP08]
U501  lme49710  OPAMPLME49710  [DIP08-KIT]
U502  LM3915N  [DIL18]

### Nets
1TO1 [signal]: R501.P$2 ; also sheet 1
2TO1 [signal]: R502.P$2 ; also sheet 2
3TO1 [signal]: R503.P$2 ; also sheet 3
4TO1 [signal]: R504.P$2 ; also sheet 4
GND [power]: C4.NEG(-) C503.P$2 C504.P$1 C505.P$2 J501.2 R505.P$1 R508.P$2 R509.P$2 U1.5(+IN) U502.2(V-) U502.4(RLO) ; also sheet 1,2,3,4,6,7
HIGHEST1 [signal]: D502.20(C) U502.10(LED10)
LOWEST1 [signal]: D502.11(C9) U502.1(LED1)
N$25: D3.A R4.P$2 R5.P$1 U1.6(-IN)
N$26: D3.C D4.A U1.7(OUT)
N$36: D4.C R5.P$2 R6.P$1
N$38: C3.NEG(-) R4.P$1
N$39: C4.POS(+) R6.P$2 U502.5(SIGIN)
N$149 [signal]: R505.P$2 U501.3(.1:+IN)
N$150 [signal]: C501.P$1 R501.P$1 R502.P$1 R503.P$1 R504.P$1 R506.P$2 U501.2(.1:-IN)
N$151 [signal]: C505.P$1 FB501.P$2 J501.1
N$152 [signal]: C3.POS(+) C502.NEG(-) D501.AC1(~) D501.AC2(~2) FB501.P$1 R508.P$1
N$153 [signal]: D502.12(C8) U502.18(LED2)
N$154 [signal]: D502.13(C7) U502.17(LED3)
N$155 [signal]: D502.14(C6) U502.16(LED4)
N$156 [signal]: D502.15(C5) U502.15(LED5)
N$157 [signal]: D502.16(C4) U502.14(LED6)
N$158 [signal]: D502.17(C3) U502.13(LED7)
N$159 [signal]: D502.18(C2) U502.12(LED8)
N$160 [signal]: D502.19(C1) U502.11(LED9)
N$161 [signal]: R510.P$1 R511.P$2 U502.7(REFOUT)
N$162 [signal]: R509.P$1 R510.P$2 U502.8(REFADJ)
N$163 [signal]: C501.P$2 R507.P$2 U501.6(.1:OUT)
N$164 [signal]: C502.POS(+) R506.P$1 R507.P$1
N$165 [signal]: R511.P$1 U502.6(RHI)
VCC [power]: C503.P$1 D501.POS(+) D502.1(A) D502.2(A1) D502.3(A2) D502.4(A3) D502.5(A4) D502.6(A5) D502.7(A6) D502.8(A7) D502.9(A8) D502.10(A9) U501.7(.P:P$V+) U502.3(V+) ; also sheet 1,2,3,4,6,7
VNEG [power]: C504.P$2 D501.NEG(-) U501.4(.P:P$V-) ; also sheet 1,2,3,4,6,7
Unconnected: U502.9(MODE)

### Notes on the sheet
- Mode pin floats for dot display.
  Conect to V+ for bar.
- Need a peak detector or something here?
  Datasheet pg 12
- Output circuit is combo of Self, 15.2.a (p383), 
  plus clamp & fb from THAT 1646 datasheet

## Sheet 6 of 7
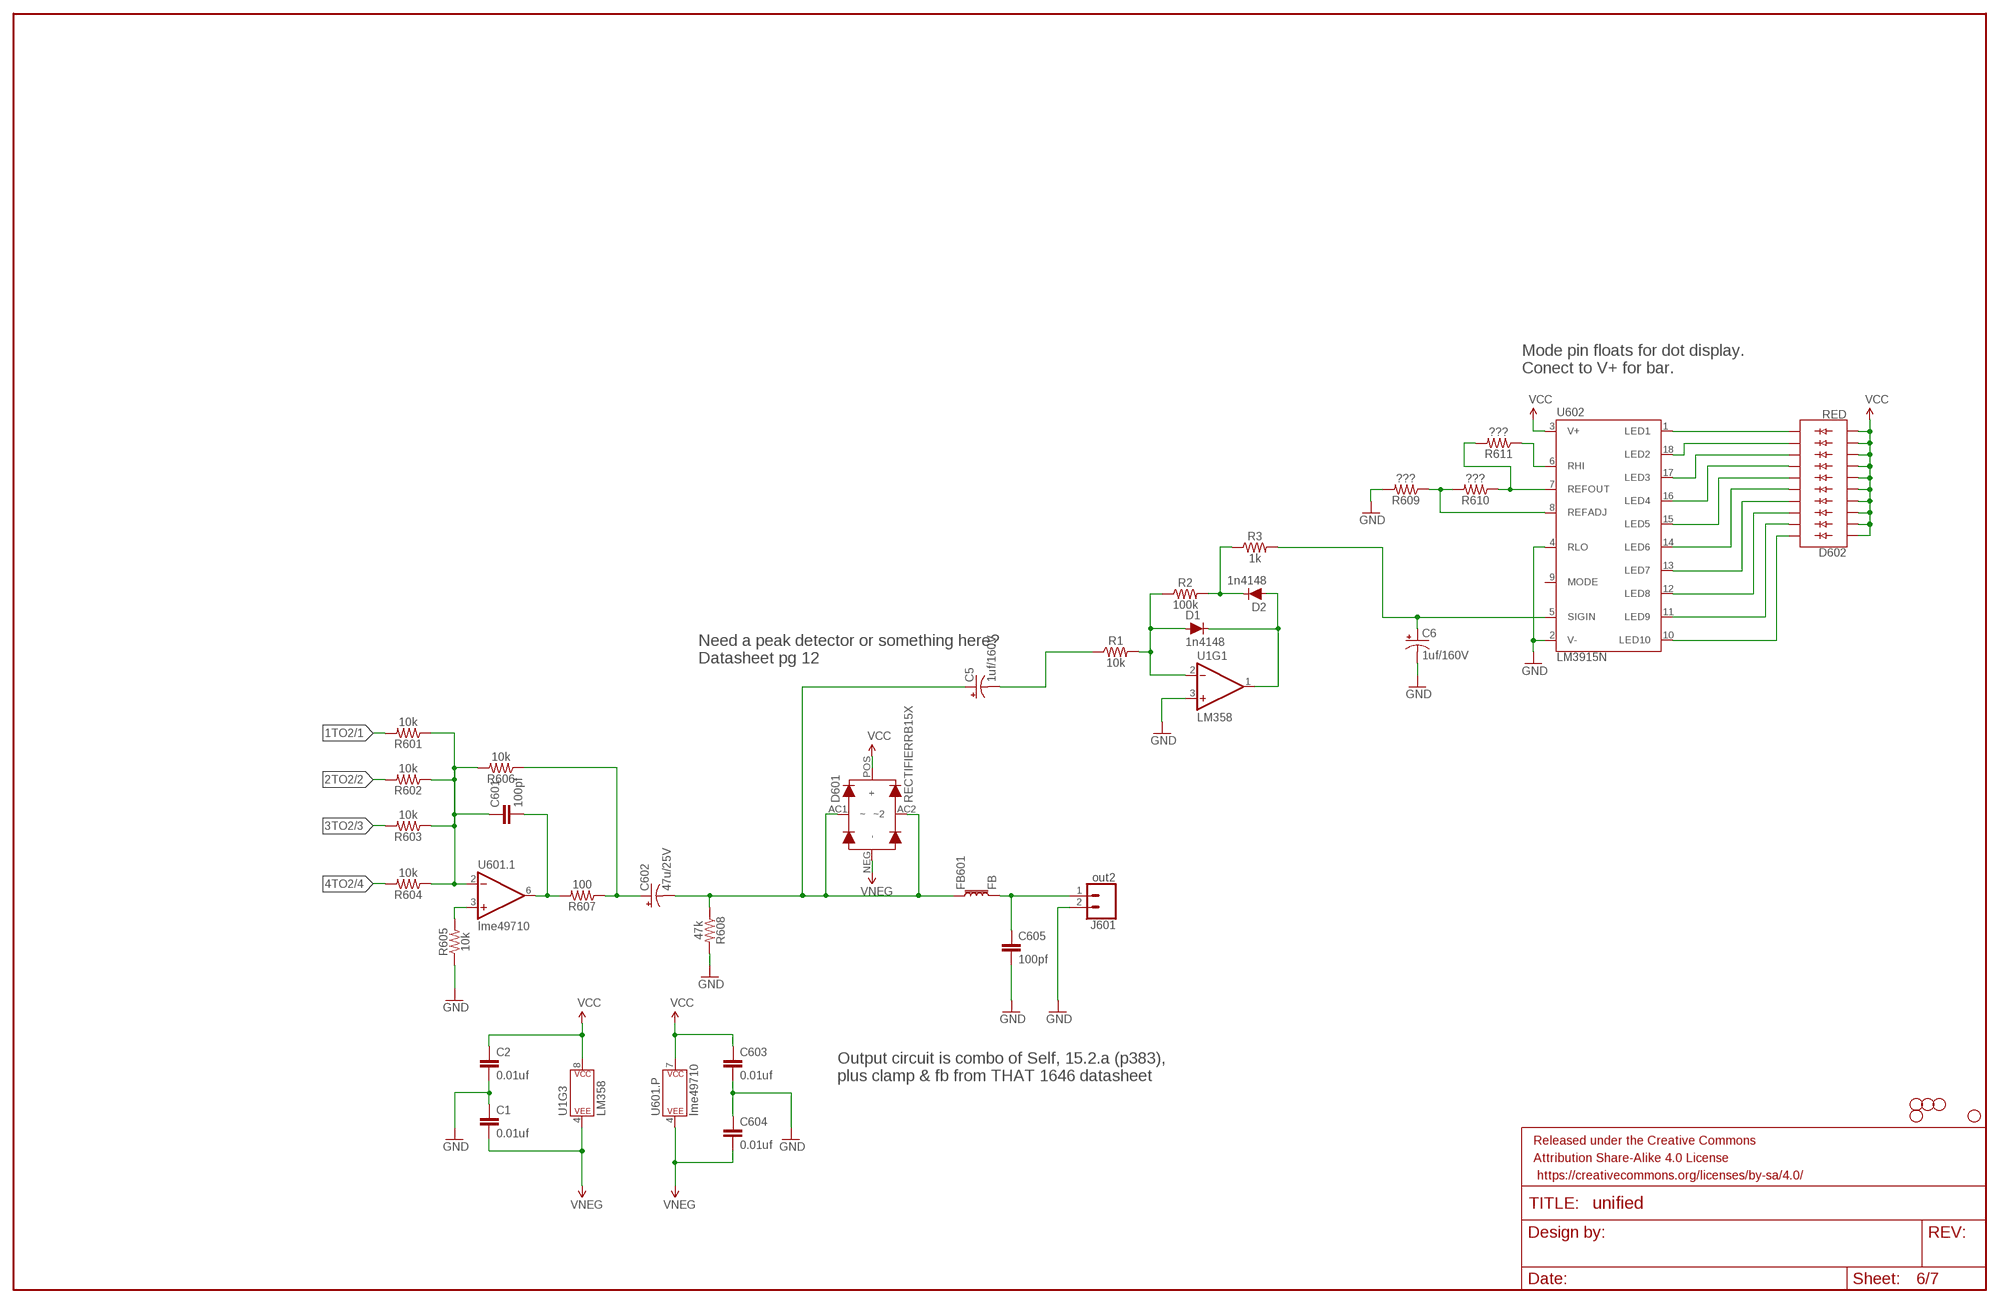
[diagram p5: schematic, sheet 6]

### Parts
C1  0.01uf  WIMA-MKS20.01UF  [WIMA-MKS2-2.5X7.2]
C2  0.01uf  WIMA-MKS20.01UF  [WIMA-MKS2-2.5X7.2]
C5  1uf/160V  CAP-LYTIC1UF/160V  [CAP-PANA-2.5LS-6DIAM]
C6  1uf/160V  CAP-LYTIC1UF/160V  [CAP-PANA-2.5LS-6DIAM]
C601  100pf  CAP-CERAMIC100PF  [CAP-KEMET-GM-2.54LS]
C602  47u/25V  CAP-LYTIC47U/25V  [CAP-PANA-2LS-5DIAM]
C603  0.01uf  WIMA-MKS20.01UF  [WIMA-MKS2-2.5X7.2]
C604  0.01uf  WIMA-MKS20.01UF  [WIMA-MKS2-2.5X7.2]
C605  100pf  CAP-CERAMIC100PF  [CAP-KEMET-GM-2.54LS]
D1  1n4148  DIODE-1N4148  [DIODE-1N4148]
D2  1n4148  DIODE-1N4148  [DIODE-1N4148]
D601  RECTIFIERRB15X  [SM-RECTIFIER]
D602  RED  LED_BARGRAPH_10RED  [LED_BARGRAPH_10]
FB601  FB  [BEAD]
FRAME601  FRAME-LEDGER  [CREATIVE_COMMONS]
H601  STAND-OFF  [STAND-OFF]
H602  STAND-OFF  [STAND-OFF]
H603  STAND-OFF  [STAND-OFF]
H605  STAND-OFF  [STAND-OFF]
H612  STAND-OFF  [STAND-OFF]
J601  out2  CONN_02LOCK_LONGPADS  [1X02_LOCK_LONGPADS]
R1  10k  RESISTOR  [AXIAL-0.3]
R2  100k  RESISTOR  [AXIAL-0.3]
R3  1k  RESISTOR  [AXIAL-0.3]
R601  10k  RESISTOR  [AXIAL-0.3]
R602  10k  RESISTOR  [AXIAL-0.3]
R603  10k  RESISTOR  [AXIAL-0.3]
R604  10k  RESISTOR  [AXIAL-0.3]
R605  10k  RESISTOR  [AXIAL-0.3]
R606  10k  RESISTOR  [AXIAL-0.3]
R607  100  RESISTOR  [AXIAL-0.3]
R608  47k  RESISTOR  [AXIAL-0.3]
R609  ???  RESISTOR  [AXIAL-0.3]
R610  ???  RESISTOR  [AXIAL-0.3]
R611  ???  RESISTOR  [AXIAL-0.3]
U601  lme49710  OPAMPLME49710  [DIP08-KIT]
U602  LM3915N  [DIL18]

### Nets
1TO2 [signal]: R601.P$2 ; also sheet 1
2TO2 [signal]: R602.P$2 ; also sheet 2
3TO2 [signal]: R603.P$2 ; also sheet 3
4TO2 [signal]: R604.P$2 ; also sheet 4
GND [power]: C1.P$1 C2.P$2 C6.NEG(-) C603.P$2 C604.P$1 C605.P$2 J601.2 R605.P$1 R608.P$2 R609.P$2 U1.3(+IN) U602.2(V-) U602.4(RLO) ; also sheet 1,2,3,4,5,7
HIGHEST [signal]: D602.20(C) U602.10(LED10)
LOWEST [signal]: D602.11(C9) U602.1(LED1)
N$5: D1.A R1.P$2 R2.P$1 U1.2(-IN)
N$7 [signal]: C605.P$1 FB601.P$2 J601.1
N$9: D1.C D2.A U1.1(OUT)
N$11 [signal]: C5.POS(+) C602.NEG(-) D601.AC1(~) D601.AC2(~2) FB601.P$1 R608.P$1
N$12 [signal]: C602.POS(+) R606.P$1 R607.P$1
N$13 [signal]: R605.P$2 U601.3(.1:+IN)
N$16 [signal]: C601.P$2 R607.P$2 U601.6(.1:OUT)
N$17 [signal]: C601.P$1 R601.P$1 R602.P$1 R603.P$1 R604.P$1 R606.P$2 U601.2(.1:-IN)
N$18: D2.C R2.P$2 R3.P$1
N$23: C6.POS(+) R3.P$2 U602.5(SIGIN)
N$41 [signal]: D602.12(C8) U602.18(LED2)
N$43 [signal]: D602.13(C7) U602.17(LED3)
N$44 [signal]: D602.14(C6) U602.16(LED4)
N$45 [signal]: D602.15(C5) U602.15(LED5)
N$46 [signal]: D602.16(C4) U602.14(LED6)
N$47 [signal]: D602.17(C3) U602.13(LED7)
N$48 [signal]: D602.18(C2) U602.12(LED8)
N$49 [signal]: D602.19(C1) U602.11(LED9)
N$51 [signal]: R610.P$1 R611.P$2 U602.7(REFOUT)
N$52 [signal]: R609.P$1 R610.P$2 U602.8(REFADJ)
N$53 [signal]: R611.P$1 U602.6(RHI)
N$54 [signal]: C5.NEG(-) R1.P$1
VCC [power]: C2.P$1 C603.P$1 D601.POS(+) D602.1(A) D602.2(A1) D602.3(A2) D602.4(A3) D602.5(A4) D602.6(A5) D602.7(A6) D602.8(A7) D602.9(A8) D602.10(A9) U1.8(P$V+) U601.7(.P:P$V+) U602.3(V+) ; also sheet 1,2,3,4,5,7
VNEG [power]: C1.P$2 C604.P$2 D601.NEG(-) U1.4(P$V-) U601.4(.P:P$V-) ; also sheet 1,2,3,4,5,7
Unconnected: U602.9(MODE)

### Notes on the sheet
- Mode pin floats for dot display.
  Conect to V+ for bar.
- Need a peak detector or something here?
  Datasheet pg 12
- Output circuit is combo of Self, 15.2.a (p383), 
  plus clamp & fb from THAT 1646 datasheet

## Sheet 7 of 7
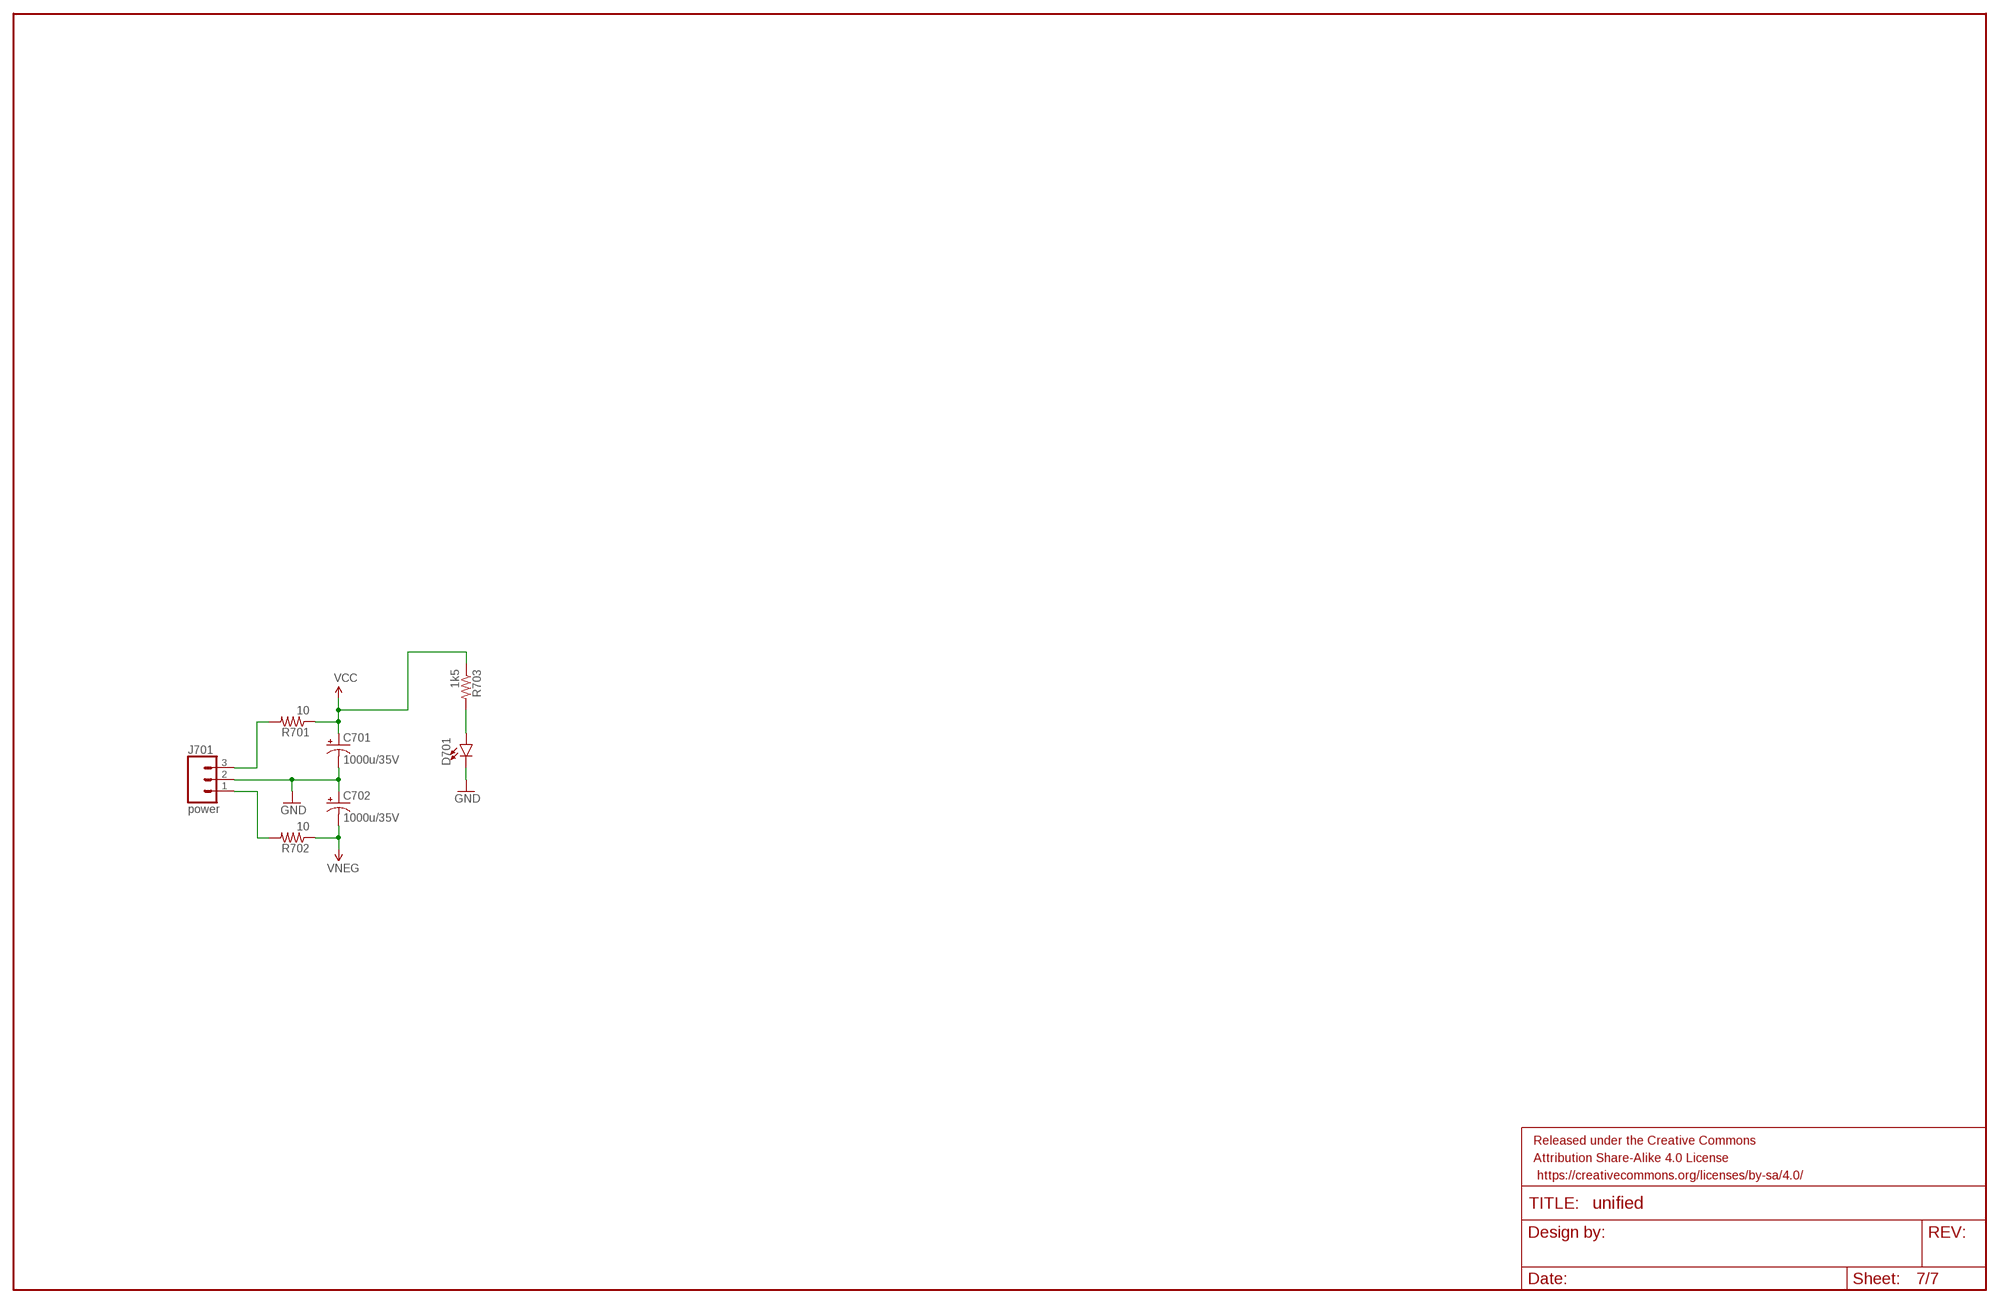
[diagram p6: schematic, sheet 7]

### Parts
C701  1000u/35V  CAP-LYTIC1000U/35V  [CAP-PANA-5LS-12.5DIAM]
C702  1000u/35V  CAP-LYTIC1000U/35V  [CAP-PANA-5LS-12.5DIAM]
D701  LED5MM  [LED_5MM]
FRAME701  FRAME-LEDGER  [CREATIVE_COMMONS]
J701  power  CONN_03POLAR_LOCK  [MOLEX-1X3_LOCK]
R701  10  RESISTORAXIAL-0.3  [AXIAL-0.3]
R702  10  RESISTORAXIAL-0.3  [AXIAL-0.3]
R703  1k5  RESISTORAXIAL-0.3  [AXIAL-0.3]

### Nets
GND [power]: C701.NEG(-) C702.POS(+) D701.K(C) J701.2 ; also sheet 1,2,3,4,5,6
N$166 [power]: J701.1 R702.P$2
N$167 [power]: J701.3 R701.P$2
N$168: D701.A R703.P$2
VCC [power]: C701.POS(+) R701.P$1 R703.P$1 ; also sheet 1,2,3,4,5,6
VNEG [power]: C702.NEG(-) R702.P$1 ; also sheet 1,2,3,4,5,6

## Library data of the parts
C1 C2 C121 C122 C221 C222 C321 C322 C421 C422 C503 C504 C603 C604 = mixer:WIMA-MKS2; MOUSER: 505-MKS20.01/63/5
C3-C6 = mixer:CAP-LYTIC; MOUSER: 667-ECA-2CHG010
C101 C102 C201 C202 C301 C302 C401 C402 = mixer:CAP-CERAMIC; MOUSER: 80-C315C470J5G
C103-C106 C112 C113 C203-C206 C212 C213 C303-C306 C312 C313 C403-C406 C412 C413 = mixer:CAP-CERAMIC; MOUSER: 80-C315C471J1G
C107 C108 C207 C208 C307 C308 C407 C408 = mixer:CAP-LYTIC; MOUSER: 667-EEU-FR1J470B
C109 C110 C114 C120 C209 C210 C214 C220 C309 C310 C314 C320 C409 C410 C414 C420 C502 C602 = mixer:CAP-LYTIC; MOUSER: 667-EEU-FR1E470B
C111 C211 C311 C411 = mixer:CAP-LYTIC; MOUSER: 667-EEU-FR1A682L
C115 C116 C215 C216 C315 C316 C415 C416 = mixer:WIMA-MKS2; MOUSER: 505-MKS2.1/63/5
C117 C118 C217 C218 C317 C318 C417 C418 = mixer:WIMA-MKS2; MOUSER: 505-MKS20.015/63/5
C119 C219 C319 C419 C501 C505 C601 C605 = mixer:CAP-CERAMIC; MOUSER: 80-C315C101J5G
C701 C702 = mixer:CAP-LYTIC; MOUSER: 667-EEU-FR1V102
D1-D4 = SparkFun-DiscreteSemi:DIODE: Diode These are standard reverse protection diodes and small signal diodes. SparkFun Products: SparkFun SparkPunk Sound Kit <https://www.sparkfun.com/products/11177> SparkFun ESP8266 Thing <https://www.sparkfun.com/products/13231>; PROD_ID: DIO-08378; VALUE: 200mA/100V/1V
D101 D201 D301 D401 D501 D601 = mixer:RECTIFIER; MOUSER: 583-RB153
D102 D103 D202 D203 D302 D303 D402 D403 = SparkFun-DiscreteSemi:DIODE: Diode These are standard reverse protection diodes and small signal diodes. SparkFun Products: SparkFun SparkPunk Sound Kit <https://www.sparkfun.com/products/11177> SparkFun ESP8266 Thing <https://www.sparkfun.com/products/13231>; PROD_ID: DIO-08378
D502 D602 = SparkFun-LED:LED_BARGRAPH_10: Young Sun LED Tech - YSLB-10251G5-10 10-Segment LED Bar Graph Features: Red Vf = 2.1V, Ifmax = 20mA Yellow Vf = 2.1V, Ifmax = 20mA Blue Vf = 3.4V, Ifmax = 20mA Green Vf = 3.4V, Ifmax = 20mA SparkFun Products: Red <https://www.sparkfun.com/products/9935> Yellow <https://www.sparkfun.com/products/9936> Green <https://www.sparkfun.com/products/9938> Blue <https://www.sparkfun.com/products/9937>; PROD_ID: DIO-10615
D701 = SparkFun-LED:LED: LED (Generic) Standard schematic elements and footprints for 5mm, 3mm, 1206, and 0603 sized LEDs. Generic LEDs with no color specified.
FB501 FB601 = mixer:FB; MOUSER: 623-2743002112LF
FRAME101 FRAME201 FRAME301 FRAME401 FRAME501 FRAME601 FRAME701 = SparkFun-Aesthetics:FRAME-LEDGER: Schematic Frame - Ledger Standard 11x14 US Ledger frame
H601-H603 H605 H612 = SparkFun-Hardware:STAND-OFF: Stand Off Drill holes for mechanically mounting via screws, standoffs, etc. Note: Use the keepout ring to avoid running the screw head into surrounding components. Variant Overviews STAND-OFF - Mechanical footprint for a #4 phillips button head screw. STAND-OFF-TIGHT - Mechanical footprint for a #4 phillips button head screw, Example SparkFun Products Screw - Phillips Head (1/4", 4-40, 10 pack) <https://www.sparkfun.com/products/10453> (PRT-10453) Screw - Phillips Head (1/2", 4-40, 10 pack) <https://www.sparkfun.com/products/10452> (PRT-10452) Screw - Phillips Head (3/4", 4-40, 10 pack) <https://www.sparkfun.com/products/10451> (PRT-10451) Screw - Phillips Head (1", 4-40, 10 pack) <https://www.sparkfun.com/products/10450> (PRT-10450)
IC101 IC201 IC301 IC401 = mixer:THAT151X; MOUSER: 887-1512P08-U
J101 J102 J201 J202 J301 J302 J401 J402 = SparkFun-Connectors:M03: Header 3 Standard 3-pin 0.1" header. Use with straight break away headers (SKU : PRT-00116), right angle break away headers (PRT-00553), swiss pins (PRT-00743), machine pins (PRT-00117), and female headers (PRT-00115). Molex polarized connector foot print use with SKU : PRT-08232 with associated crimp pins and housings.
J103-J105 J203-J205 J303-J305 J403-J405 = SparkFun-Connectors:M01: Header 1 Standard 1-pin 0.1" header. Use with straight break away headers (SKU : PRT-00116), right angle break away headers (PRT-00553), swiss pins (PRT-00743), machine pins (PRT-00117), and female headers (PRT-00115). SMTSO-256-ET is a "flush mount" nut for a 4-40 screw. The older package used to be too tight, and did not allow it to sit properly thru the drill hit. The latest (0.165DIA) fits nice and snug.
J106 J206 J306 J406 = SparkFun-Connectors:CONN_05: Multi connection point. Often used as Generic Header-pin footprint for 0.1 inch spaced/style header connections On any of the 0.1 inch spaced packages, you can populate with these: Break Away Headers - Straight <https://www.sparkfun.com/products/116> (PRT-00116) Break Away Male Headers - Right Angle <https://www.sparkfun.com/products/553> (PRT-00553) Female Headers <https://www.sparkfun.com/products/115> (PRT-00115) Break Away Headers - Machine Pin <https://www.sparkfun.com/products/117> (PRT-00117) Break Away Female Headers - Swiss Machine Pin <https://www.sparkfun.com/products/743> (PRT-00743) For SCREWTERMINALS and SPRING TERMINALS visit here: Screw Terimnals on SparkFun.com <https://www.sparkfun.com/search/results?term=Screw+Terminals> (5mm/3.5mm/2.54mm spacing) This device is also useful as a general connection point to wire up your design to another part of your project. Our various solder wires solder well into these plated through hole pads. Hook-Up Wire - Assortment (Stranded, 22 AWG) <https://www.sparkfun.com/products/11375> (PRT-11375) Hook-Up Wire - Assortment (Solid Core, 22 AWG) <https://www.sparkfun.com/products/11367> (PRT-11367) View the entire wire category on our website here <https://www.sparkfun.com/categories/141> Special notes: Molex polarized connector foot print use with SKU : PRT-08231 with associated crimp pins and housings. 1MM SMD Version SKU: PRT-10208
J501 J601 = SparkFun-Connectors:CONN_02: Multi connection point. Often used as Generic Header-pin footprint for 0.1 inch spaced/style header connections On any of the 0.1 inch spaced packages, you can populate with these: Break Away Headers - Straight <https://www.sparkfun.com/products/116> (PRT-00116) Break Away Male Headers - Right Angle <https://www.sparkfun.com/products/553> (PRT-00553) Female Headers <https://www.sparkfun.com/products/115> (PRT-00115) Break Away Headers - Machine Pin <https://www.sparkfun.com/products/117> (PRT-00117) Break Away Female Headers - Swiss Machine Pin <https://www.sparkfun.com/products/743> (PRT-00743) For SCREWTERMINALS and SPRING TERMINALS visit here: Screw Terimnals on SparkFun.com <https://www.sparkfun.com/search/results?term=Screw+Terminals> (5mm/3.5mm/2.54mm spacing) This device is also useful as a general connection point to wire up your design to another part of your project. Our various solder wires solder well into these plated through hole pads. Hook-Up Wire - Assortment (Stranded, 22 AWG) <https://www.sparkfun.com/products/11375> (PRT-11375) Hook-Up Wire - Assortment (Solid Core, 22 AWG) <https://www.sparkfun.com/products/11367> (PRT-11367) View the entire wire category on our website here <https://www.sparkfun.com/categories/141> Special notes: Molex polarized connector foot print use with: PRT-08233 with associated crimp pins and housings. 2.54_SCREWTERM for use with PRT-10571. 3.5mm Screw Terminal footprints for PRT-08084 5mm Screw Terminal footprints for use with PRT-08432
J701 = SparkFun-Connectors:CONN_03: Multi connection point. Often used as Generic Header-pin footprint for 0.1 inch spaced/style header connections On any of the 0.1 inch spaced packages, you can populate with these: Break Away Headers - Straight <https://www.sparkfun.com/products/116> (PRT-00116) Break Away Male Headers - Right Angle <https://www.sparkfun.com/products/553> (PRT-00553) Female Headers <https://www.sparkfun.com/products/115> (PRT-00115) Break Away Headers - Machine Pin <https://www.sparkfun.com/products/117> (PRT-00117) Break Away Female Headers - Swiss Machine Pin <https://www.sparkfun.com/products/743> (PRT-00743) Stackable Header - 3 Pin (Female, 0.1") <https://www.sparkfun.com/products/13875> (PRT-13875) For SCREWTERMINALS and SPRING TERMINALS visit here: Screw Terimnals on SparkFun.com <https://www.sparkfun.com/search/results?term=Screw+Terminals> (5mm/3.5mm/2.54mm spacing) This device is also useful as a general connection point to wire up your design to another part of your project. Our various solder wires solder well into these plated through hole pads. Hook-Up Wire - Assortment (Stranded, 22 AWG) <https://www.sparkfun.com/products/11375> (PRT-11375) Hook-Up Wire - Assortment (Solid Core, 22 AWG) <https://www.sparkfun.com/products/11367> (PRT-11367) View the entire wire category on our website here <https://www.sparkfun.com/categories/141> Special notes: Molex polarized connector foot print use with SKU : PRT-08232 with associated crimp pins and housings.; PROD_ID: CONN-08625; SF_ID: PRT-08096
R1-R6 R101-R116 R201-R216 R301-R316 R401-R416 R501-R511 R601-R611 = mixer:RESISTOR
R701-R703 = SparkFun-Resistors:RESISTOR: Resistor Basic schematic elements and footprints for 0603, 1206, and PTH resistors.
U1 = mixer:LM358: LM358 Jellybean op-amp Datasheet <http://www.sparkfun.com/datasheets/Components/General/LM358.pdf> SparkFun Products Op-Amp (Thru-Hole) - LM358 <https://www.sparkfun.com/products/9456> (COM-09456); PROD_ID: IC-09172
U101 U201 U301 U401 U501 U601 = mixer:OPAMP; MFR: lme49710; MOUSER: 926-LME49710NA/NOPB
U502 U602 = SparkFun-IC-Special-Function:LM391: LM3914 Dot/Bar Display Driver TTL/CMOS Logic Drives LEDs, LCDs, Vacuum Fluorecents Source: Data sheet LM3915 <http://www.national.com/ds/LM/LM3915.pdf> Data sheet LM3914 <http://www.national.com/ds/LM/LM3914.pdf> SparkFun Products: MyoWare LED Shield <https://www.sparkfun.com/products/13688> Dot/Bar Display Driver - LM3914 <https://www.sparkfun.com/products/12694>
VR101 VR201 VR301 VR401 = mixer:POT
VR102-VR105 VR202-VR205 VR302-VR305 VR402-VR405 = mixer:POT; MOUSER: 31VQ401-F3

## Net classes
1 power: width 0.61 mm, drill 0.381 mm, clearance 0.254 mm
2 signal: width 0.254 mm, drill 0.381 mm, clearance 0.254 mm